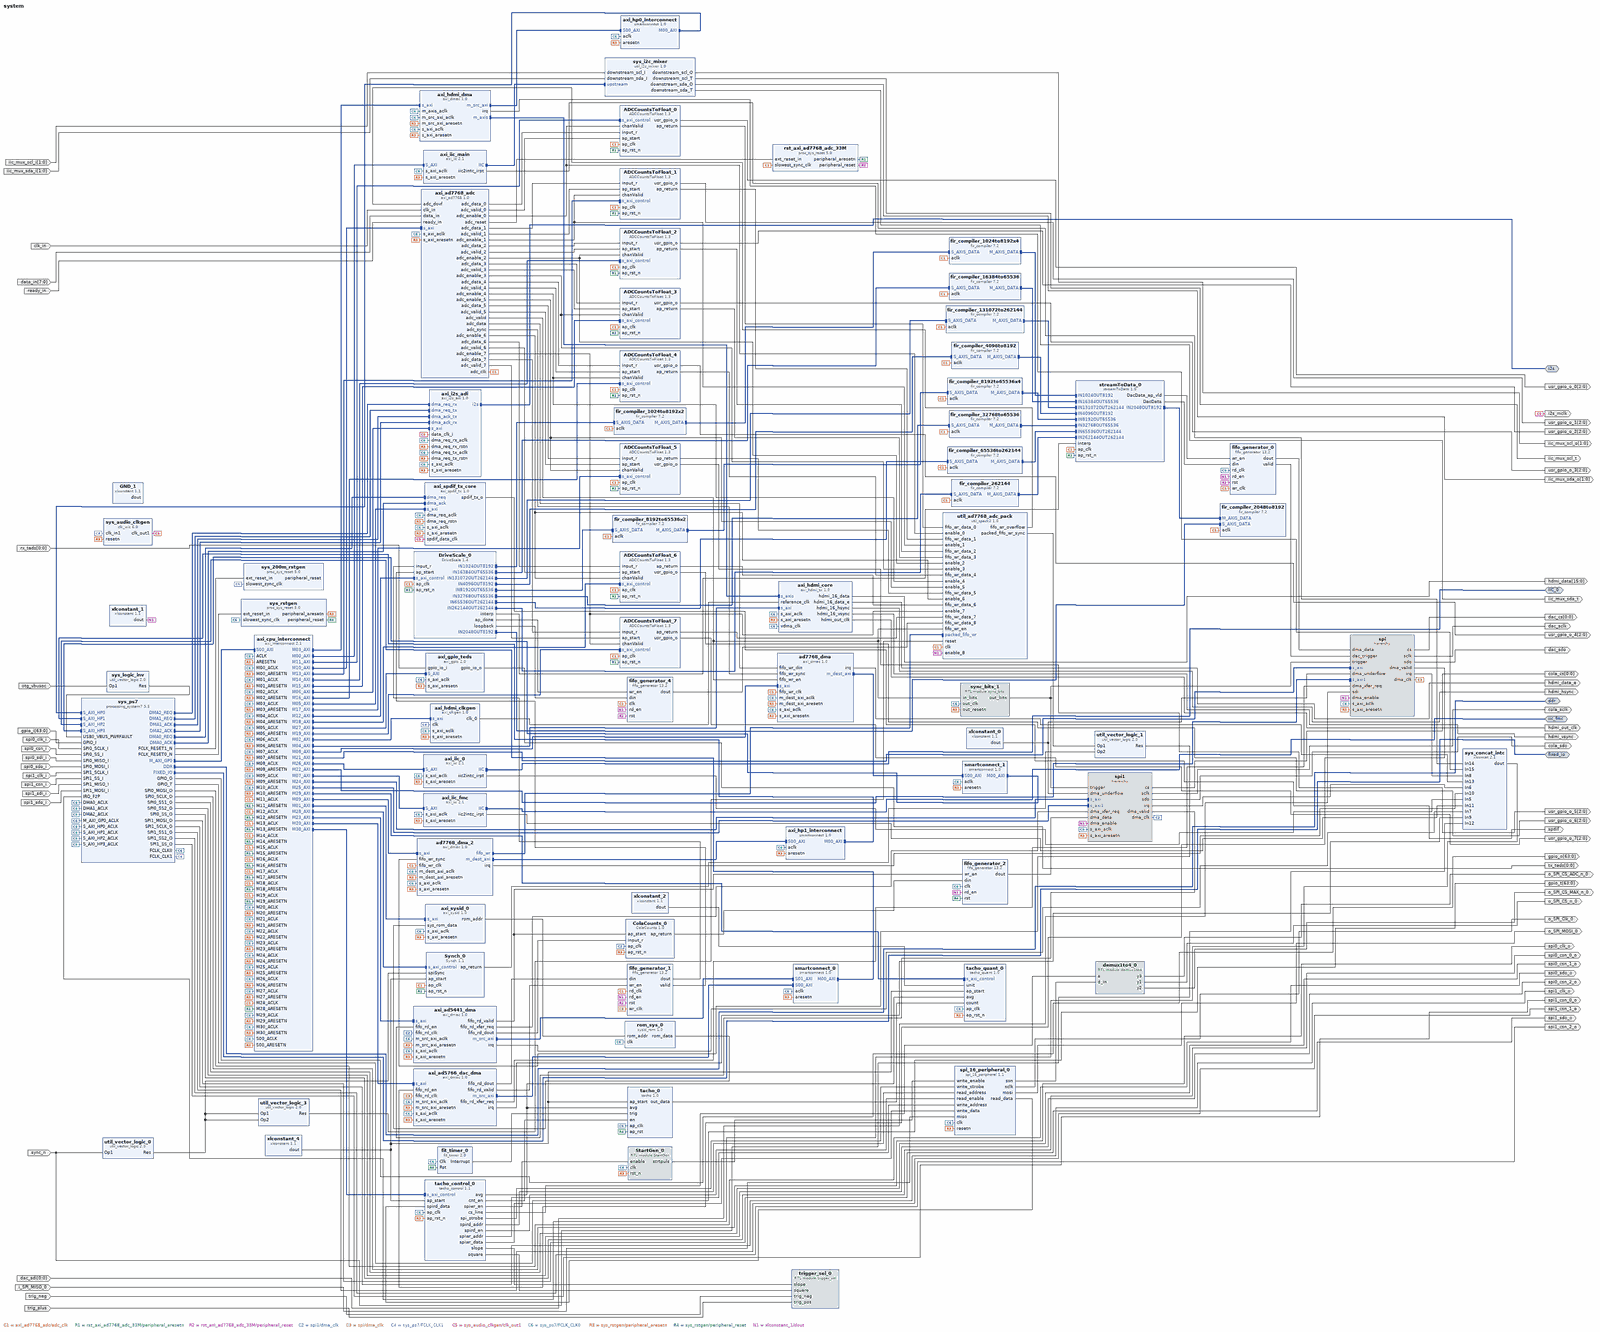
[diagram p0: block diagram of the top level, whole]
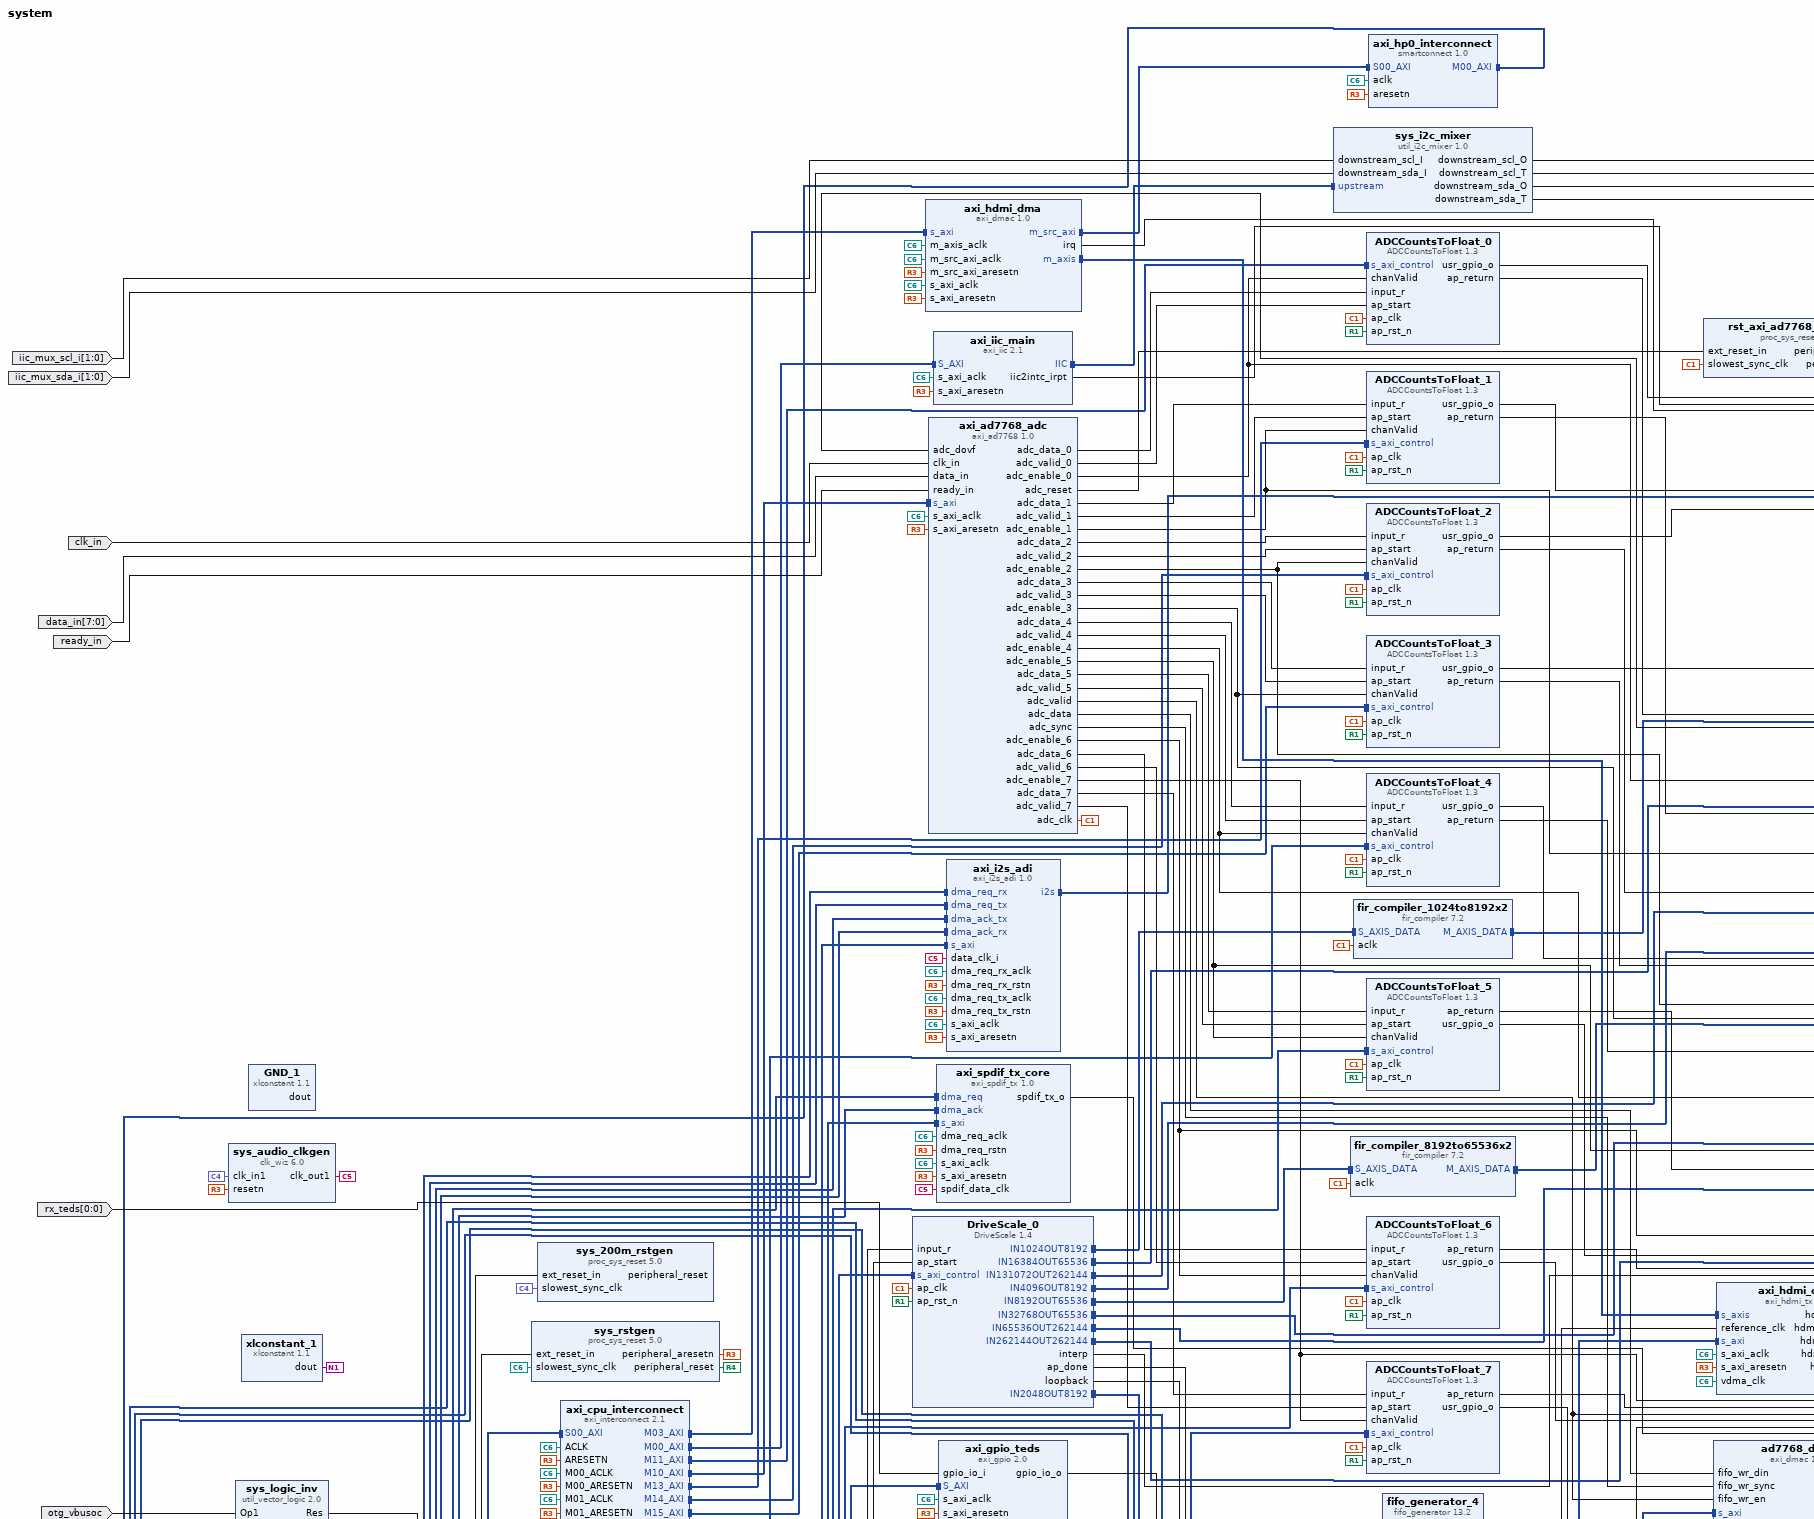
[diagram p1: block diagram of the top level, upper left part]
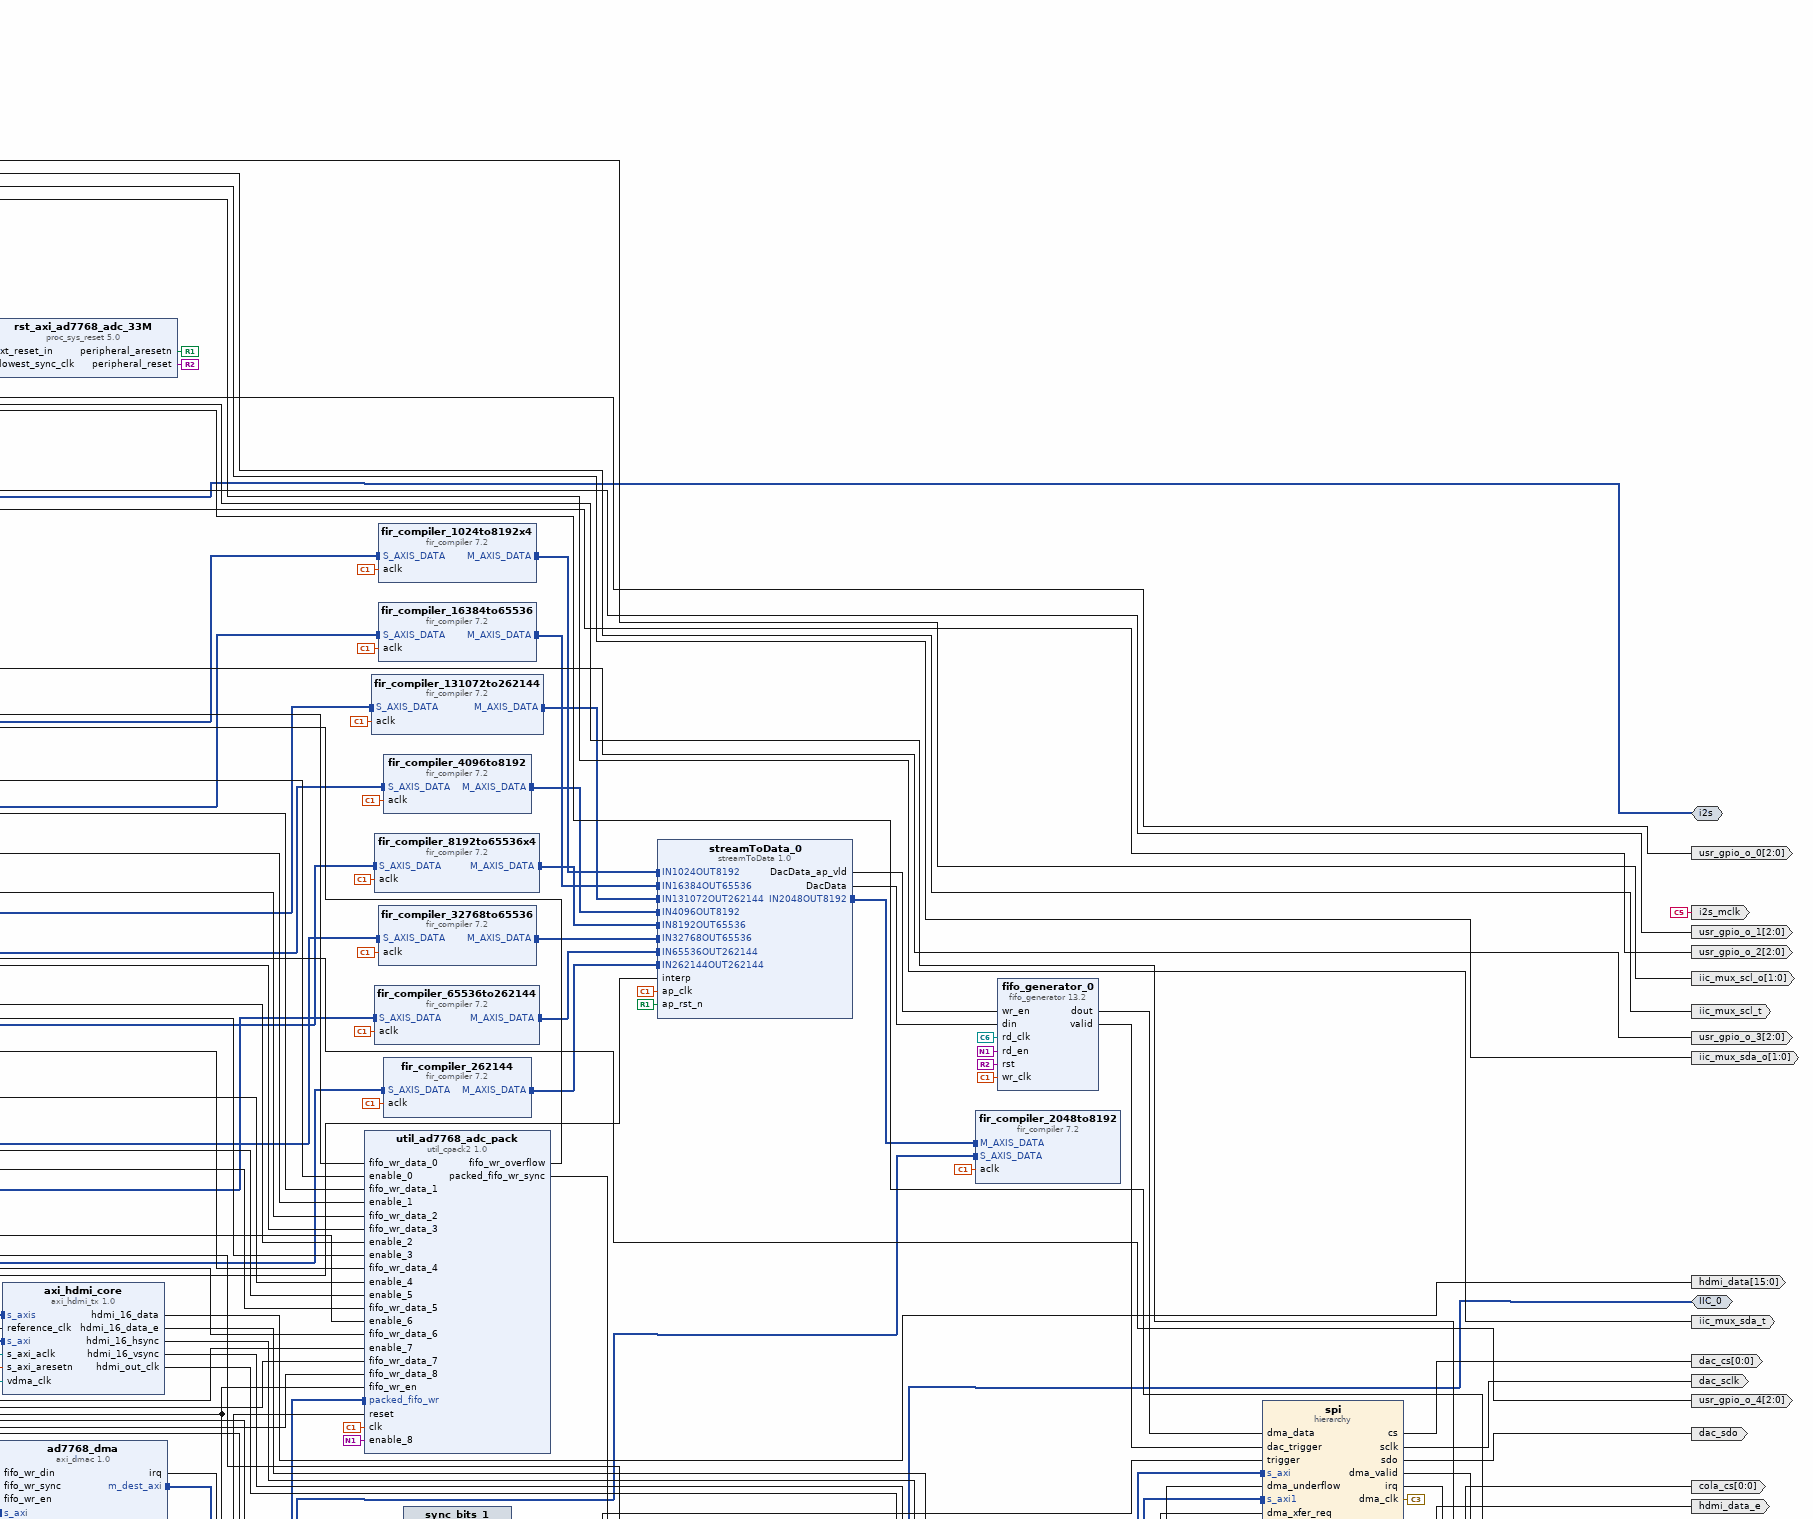
[diagram p2: block diagram of the top level, upper right part]
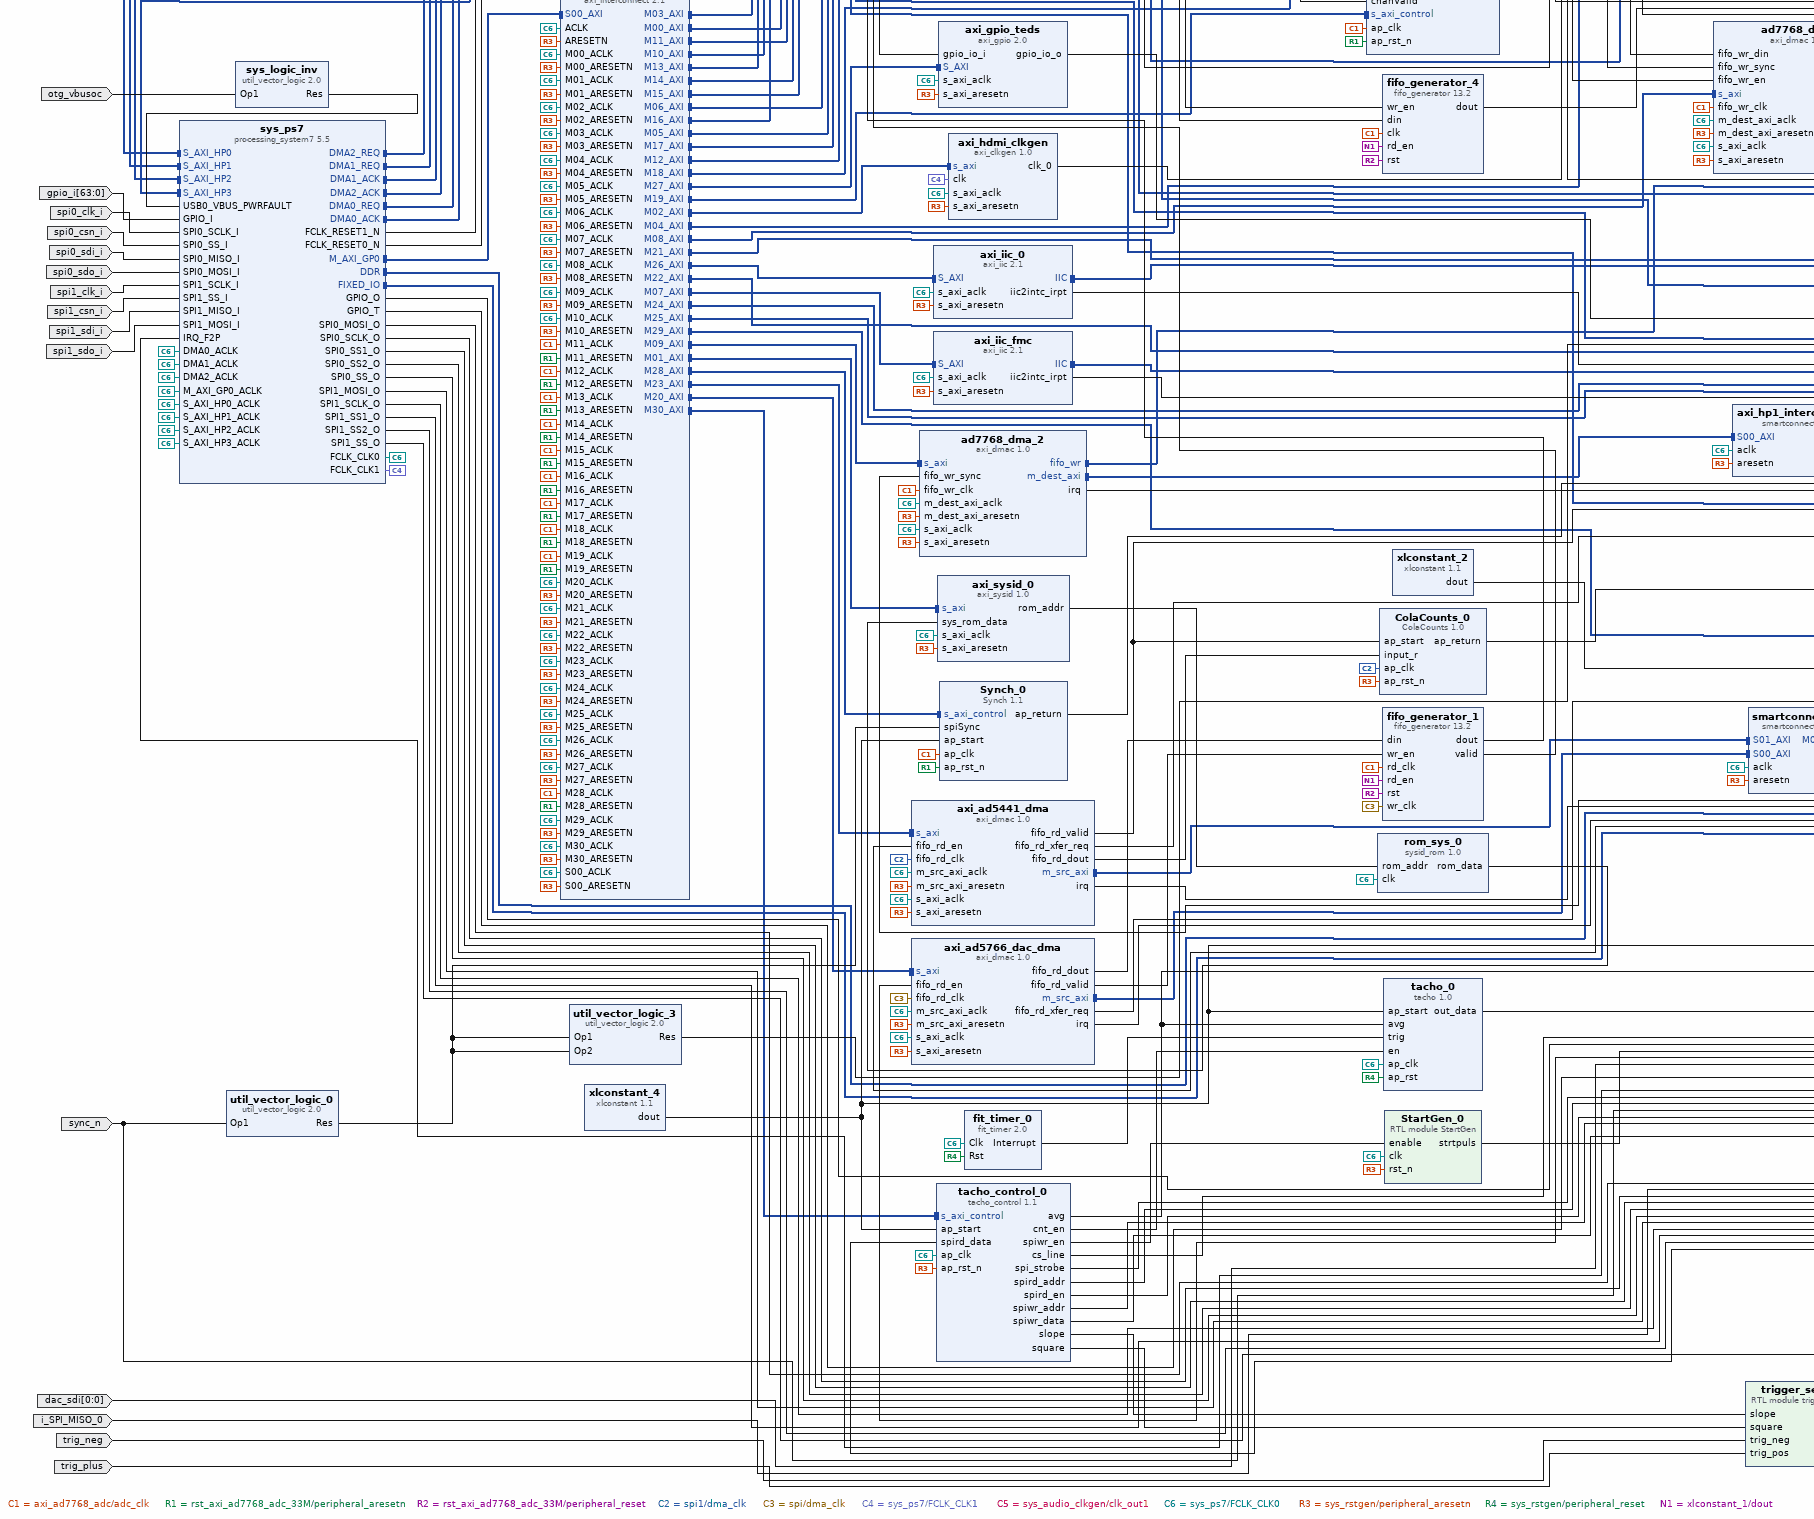
[diagram p3: block diagram of the top level, lower left part]
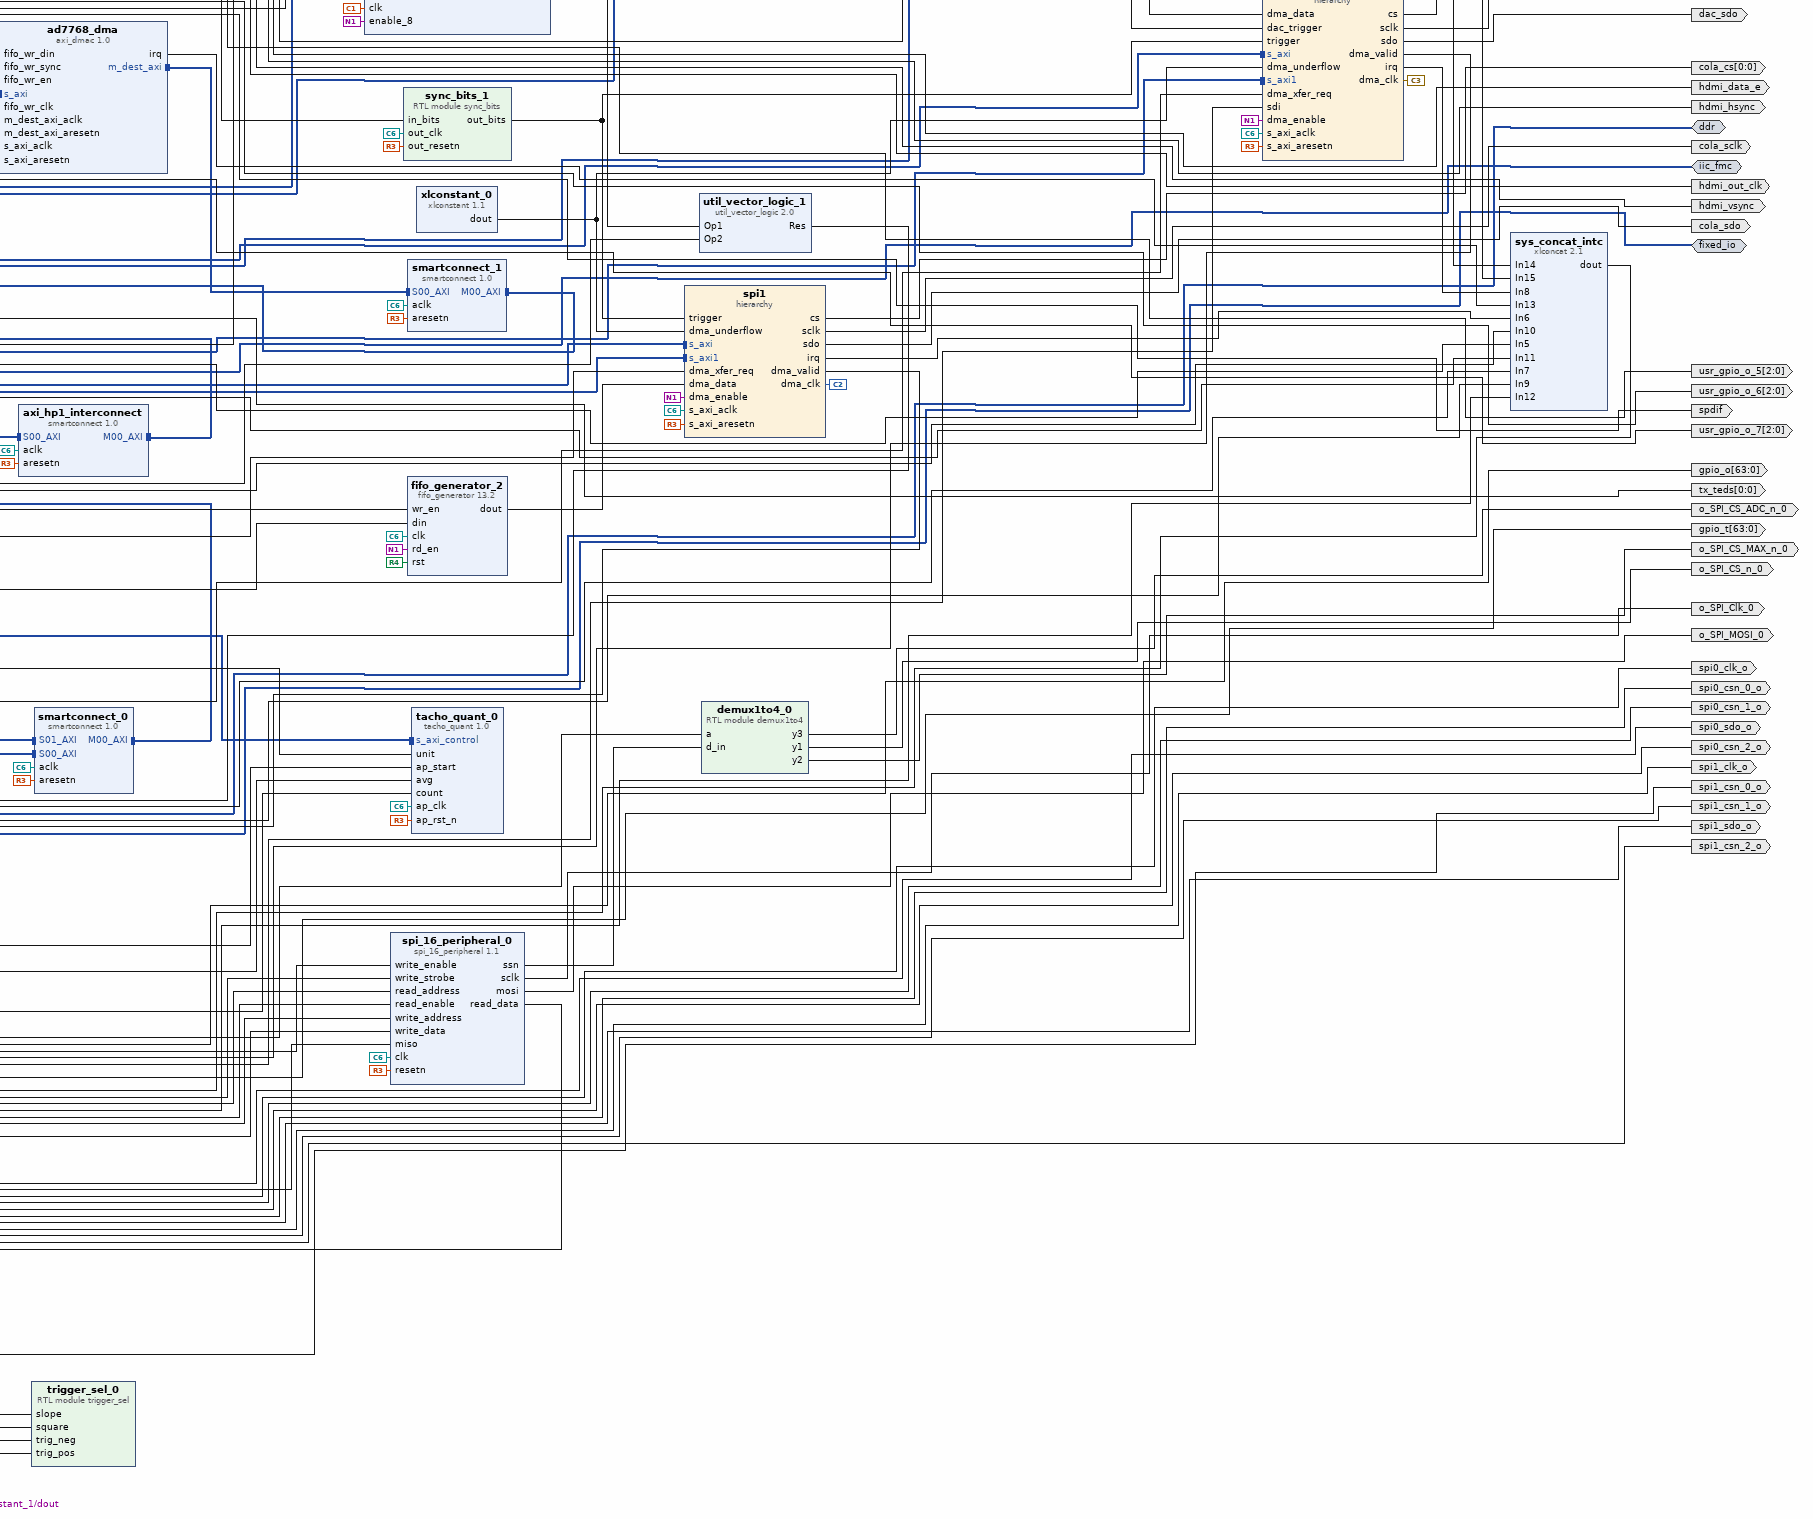
[diagram p4: block diagram of the top level, lower right part]
# Vivado block design system, xc7z020clg484-1, Vivado 2023.2
create_bd_design system

create_bd_intf_port -mode Master -vlnv xilinx.com:interface:ddrx_rtl:1.0 ddr
create_bd_intf_port -mode Master -vlnv xilinx.com:display_processing_system7:fixedio_rtl:1.0 fixed_io
create_bd_intf_port -mode Master -vlnv xilinx.com:interface:iic_rtl:1.0 iic_fmc
create_bd_intf_port -mode Master -vlnv analog.com:interface:i2s_rtl:1.0 i2s
create_bd_intf_port -mode Master -vlnv xilinx.com:interface:iic_rtl:1.0 IIC_0
create_bd_port -dir O spi0_csn_2_o
create_bd_port -dir O spi0_csn_1_o
create_bd_port -dir O spi0_csn_0_o
create_bd_port -dir I spi0_csn_i
create_bd_port -dir I spi0_clk_i
create_bd_port -dir O spi0_clk_o
create_bd_port -dir I spi0_sdo_i
create_bd_port -dir O spi0_sdo_o
create_bd_port -dir I spi0_sdi_i
create_bd_port -dir O spi1_csn_2_o
create_bd_port -dir O spi1_csn_1_o
create_bd_port -dir O spi1_csn_0_o
create_bd_port -dir I spi1_csn_i
create_bd_port -dir I spi1_clk_i
create_bd_port -dir O spi1_clk_o
create_bd_port -dir I spi1_sdo_i
create_bd_port -dir O spi1_sdo_o
create_bd_port -dir I spi1_sdi_i
create_bd_port -dir I -from 63 -to 0 gpio_i
create_bd_port -dir O -from 63 -to 0 gpio_o
create_bd_port -dir O -from 63 -to 0 gpio_t
create_bd_port -dir O hdmi_out_clk
create_bd_port -dir O hdmi_hsync
create_bd_port -dir O hdmi_vsync
create_bd_port -dir O hdmi_data_e
create_bd_port -dir O -from 15 -to 0 hdmi_data
create_bd_port -dir O -type clk i2s_mclk
create_bd_port -dir I -from 1 -to 0 iic_mux_scl_i
create_bd_port -dir O -from 1 -to 0 iic_mux_scl_o
create_bd_port -dir O iic_mux_scl_t
create_bd_port -dir I -from 1 -to 0 iic_mux_sda_i
create_bd_port -dir O -from 1 -to 0 iic_mux_sda_o
create_bd_port -dir O iic_mux_sda_t
create_bd_port -dir I otg_vbusoc
create_bd_port -dir O spdif
create_bd_port -dir I -from 7 -to 0 data_in
create_bd_port -dir O dac_sclk
create_bd_port -dir O -from 0 -to 0 dac_cs
create_bd_port -dir O dac_sdo
create_bd_port -dir I -from 0 -to 0 dac_sdi
create_bd_port -dir O cola_sclk
create_bd_port -dir O cola_sdo
create_bd_port -dir O -from 0 -to 0 cola_cs
create_bd_port -dir O -from 2 -to 0 -type data usr_gpio_o_0
create_bd_port -dir O -from 2 -to 0 -type data usr_gpio_o_1
create_bd_port -dir O -from 2 -to 0 -type data usr_gpio_o_2
create_bd_port -dir O -from 2 -to 0 -type data usr_gpio_o_3
create_bd_port -dir O -from 2 -to 0 -type data usr_gpio_o_4
create_bd_port -dir O -from 2 -to 0 -type data usr_gpio_o_5
create_bd_port -dir O -from 2 -to 0 -type data usr_gpio_o_6
create_bd_port -dir O -from 2 -to 0 -type data usr_gpio_o_7
create_bd_port -dir I -from 0 -to 0 rx_teds
create_bd_port -dir O -from 0 -to 0 tx_teds
create_bd_port -dir I -type intr sync_n
set_property -dict {CONFIG.SENSITIVITY EDGE_RISING} [get_bd_ports sync_n]
create_bd_port -dir I i_SPI_MISO_0
create_bd_port -dir O o_SPI_MOSI_0
create_bd_port -dir O o_SPI_Clk_0
create_bd_port -dir O o_SPI_CS_n_0
create_bd_port -dir O o_SPI_CS_MAX_n_0
create_bd_port -dir O o_SPI_CS_ADC_n_0
create_bd_port -dir I trig_neg
create_bd_port -dir I trig_plus
create_bd_port -dir I -type clk clk_in
set_property -dict {CONFIG.FREQ_HZ 33554432} [get_bd_ports clk_in]
create_bd_port -dir I ready_in

create_bd_cell -type ip -vlnv xilinx.com:ip:processing_system7:5.5 sys_ps7
set_property -dict [list \
  CONFIG.PCW_APU_PERIPHERAL_FREQMHZ 666.666667 \
  CONFIG.PCW_ENET0_ENET0_IO {MIO 16 .. 27} \
  CONFIG.PCW_ENET0_GRP_MDIO_ENABLE 1 \
  CONFIG.PCW_ENET0_GRP_MDIO_IO {MIO 52 .. 53} \
  CONFIG.PCW_ENET0_PERIPHERAL_ENABLE 1 \
  CONFIG.PCW_ENET0_RESET_ENABLE 0 \
  CONFIG.PCW_ENET_RESET_ENABLE 1 \
  CONFIG.PCW_ENET_RESET_SELECT {Share reset pin} \
  CONFIG.PCW_EN_CLK1_PORT 1 \
  CONFIG.PCW_EN_RST1_PORT 1 \
  CONFIG.PCW_FCLK_CLK1_BUF TRUE \
  CONFIG.PCW_FPGA0_PERIPHERAL_FREQMHZ 100 \
  CONFIG.PCW_FPGA1_PERIPHERAL_FREQMHZ 200.0 \
  CONFIG.PCW_FPGA2_PERIPHERAL_FREQMHZ 32.768 \
  CONFIG.PCW_FPGA_FCLK1_ENABLE 1 \
  CONFIG.PCW_GPIO_EMIO_GPIO_ENABLE 1 \
  CONFIG.PCW_GPIO_EMIO_GPIO_IO 64 \
  CONFIG.PCW_GPIO_MIO_GPIO_ENABLE 1 \
  CONFIG.PCW_GPIO_MIO_GPIO_IO MIO \
  CONFIG.PCW_I2C_RESET_ENABLE 1 \
  CONFIG.PCW_IMPORT_BOARD_PRESET ZedBoard \
  CONFIG.PCW_IRQ_F2P_INTR 1 \
  CONFIG.PCW_IRQ_F2P_MODE REVERSE \
  CONFIG.PCW_PRESET_BANK1_VOLTAGE {LVCMOS 1.8V} \
  CONFIG.PCW_QSPI_GRP_SINGLE_SS_ENABLE 1 \
  CONFIG.PCW_QSPI_GRP_SINGLE_SS_IO {MIO 1 .. 6} \
  CONFIG.PCW_QSPI_PERIPHERAL_ENABLE 1 \
  CONFIG.PCW_QSPI_QSPI_IO {MIO 1 .. 6} \
  CONFIG.PCW_SD0_GRP_CD_ENABLE 1 \
  CONFIG.PCW_SD0_GRP_CD_IO {MIO 47} \
  CONFIG.PCW_SD0_GRP_WP_ENABLE 1 \
  CONFIG.PCW_SD0_GRP_WP_IO {MIO 46} \
  CONFIG.PCW_SD0_PERIPHERAL_ENABLE 1 \
  CONFIG.PCW_SD0_SD0_IO {MIO 40 .. 45} \
  CONFIG.PCW_SDIO_PERIPHERAL_FREQMHZ 50 \
  CONFIG.PCW_SINGLE_QSPI_DATA_MODE x4 \
  CONFIG.PCW_SPI0_PERIPHERAL_ENABLE 1 \
  CONFIG.PCW_SPI0_SPI0_IO EMIO \
  CONFIG.PCW_SPI1_PERIPHERAL_ENABLE 1 \
  CONFIG.PCW_SPI1_SPI1_IO EMIO \
  CONFIG.PCW_UART1_PERIPHERAL_ENABLE 1 \
  CONFIG.PCW_UART1_UART1_IO {MIO 48 .. 49} \
  CONFIG.PCW_UART_PERIPHERAL_FREQMHZ 50 \
  CONFIG.PCW_UIPARAM_DDR_FREQ_MHZ 533.333313 \
  CONFIG.PCW_UIPARAM_DDR_PARTNO {MT41J128M16 HA-15E} \
  CONFIG.PCW_USB0_PERIPHERAL_ENABLE 1 \
  CONFIG.PCW_USB0_RESET_ENABLE 0 \
  CONFIG.PCW_USB0_USB0_IO {MIO 28 .. 39} \
  CONFIG.PCW_USB_RESET_ENABLE 1 \
  CONFIG.PCW_USB_RESET_SELECT {Share reset pin} \
  CONFIG.PCW_USE_DMA0 1 \
  CONFIG.PCW_USE_DMA1 1 \
  CONFIG.PCW_USE_DMA2 1 \
  CONFIG.PCW_USE_FABRIC_INTERRUPT 1 \
  CONFIG.PCW_USE_S_AXI_HP0 1 \
  CONFIG.PCW_USE_S_AXI_HP1 1 \
  CONFIG.PCW_USE_S_AXI_HP2 1 \
  CONFIG.PCW_USE_S_AXI_HP3 1 \
] [get_bd_cells sys_ps7]
# 426 more settings of sys_ps7 are not shown: defaults, MIO pin electricals, DDR timing, and values the tool derives
create_bd_cell -type ip -vlnv xilinx.com:ip:axi_iic:2.1 axi_iic_main
set_property -dict {CONFIG.IIC_BOARD_INTERFACE Custom CONFIG.USE_BOARD_FLOW true} [get_bd_cells axi_iic_main]
create_bd_cell -type ip -vlnv analog.com:user:util_i2c_mixer:1.0 sys_i2c_mixer
create_bd_cell -type ip -vlnv xilinx.com:ip:xlconcat:2.1 sys_concat_intc
set_property -dict {CONFIG.NUM_PORTS 16 CONFIG.dout_width 16} [get_bd_cells sys_concat_intc]
create_bd_cell -type ip -vlnv xilinx.com:ip:proc_sys_reset:5.0 sys_rstgen
set_property -dict {CONFIG.C_EXT_RST_WIDTH 1} [get_bd_cells sys_rstgen]
create_bd_cell -type ip -vlnv xilinx.com:ip:proc_sys_reset:5.0 sys_200m_rstgen
set_property -dict {CONFIG.C_EXT_RST_WIDTH 1} [get_bd_cells sys_200m_rstgen]
create_bd_cell -type ip -vlnv xilinx.com:ip:util_vector_logic:2.0 sys_logic_inv
set_property -dict {CONFIG.C_OPERATION not CONFIG.C_SIZE 1} [get_bd_cells sys_logic_inv]
create_bd_cell -type ip -vlnv analog.com:user:axi_clkgen:1.0 axi_hdmi_clkgen
create_bd_cell -type ip -vlnv analog.com:user:axi_hdmi_tx:1.0 axi_hdmi_core
set_property -dict {CONFIG.INTERFACE 16_BIT} [get_bd_cells axi_hdmi_core]
create_bd_cell -type ip -vlnv analog.com:user:axi_dmac:1.0 axi_hdmi_dma
set_property -dict [list \
  CONFIG.AXI_SLICE_DEST false \
  CONFIG.AXI_SLICE_SRC false \
  CONFIG.CYCLIC true \
  CONFIG.DMA_2D_TRANSFER true \
  CONFIG.DMA_DATA_WIDTH_SRC 64 \
  CONFIG.DMA_TYPE_DEST 1 \
  CONFIG.DMA_TYPE_SRC 0 \
] [get_bd_cells axi_hdmi_dma]
create_bd_cell -type ip -vlnv xilinx.com:ip:clk_wiz:6.0 sys_audio_clkgen
set_property -dict [list \
  CONFIG.CLKIN1_JITTER_PS 50.0 \
  CONFIG.CLKOUT1_JITTER 327.996 \
  CONFIG.CLKOUT1_PHASE_ERROR 264.435 \
  CONFIG.CLKOUT1_REQUESTED_OUT_FREQ 12.288 \
  CONFIG.MMCM_CLKFBOUT_MULT_F 44.375 \
  CONFIG.MMCM_CLKIN1_PERIOD 5.000 \
  CONFIG.MMCM_CLKIN2_PERIOD 10.0 \
  CONFIG.MMCM_CLKOUT0_DIVIDE_F 80.250 \
  CONFIG.MMCM_DIVCLK_DIVIDE 9 \
  CONFIG.PRIM_SOURCE No_buffer \
  CONFIG.RESET_PORT resetn \
  CONFIG.RESET_TYPE ACTIVE_LOW \
  CONFIG.USE_LOCKED false \
  CONFIG.USE_PHASE_ALIGNMENT false \
  CONFIG.USE_RESET true \
] [get_bd_cells sys_audio_clkgen]
create_bd_cell -type ip -vlnv analog.com:user:axi_spdif_tx:1.0 axi_spdif_tx_core
set_property -dict {CONFIG.DMA_TYPE 1 CONFIG.S_AXI_ADDRESS_WIDTH 16} [get_bd_cells axi_spdif_tx_core]
create_bd_cell -type ip -vlnv analog.com:user:axi_i2s_adi:1.0 axi_i2s_adi
set_property -dict {CONFIG.DMA_TYPE 1 CONFIG.S_AXI_ADDRESS_WIDTH 16} [get_bd_cells axi_i2s_adi]
create_bd_cell -type ip -vlnv xilinx.com:ip:axi_iic:2.1 axi_iic_fmc
create_bd_cell -type ip -vlnv analog.com:user:axi_sysid:1.0 axi_sysid_0
set_property -dict {CONFIG.ROM_ADDR_BITS 9} [get_bd_cells axi_sysid_0]
create_bd_cell -type ip -vlnv analog.com:user:sysid_rom:1.0 rom_sys_0
set_property -dict [list \
  CONFIG.PATH_TO_FILE C:/github/hdl-master/projects/ad7768evb/zed/mem_init_sys.txt \
  CONFIG.ROM_ADDR_BITS 9 \
] [get_bd_cells rom_sys_0]
create_bd_cell -type ip -vlnv xilinx.com:ip:xlconstant:1.1 GND_1
set_property -dict {CONFIG.CONST_VAL 0 CONFIG.CONST_WIDTH 1} [get_bd_cells GND_1]
create_bd_cell -type ip -vlnv xilinx.com:ip:axi_interconnect:2.1 axi_cpu_interconnect
set_property -dict {CONFIG.NUM_MI 31} [get_bd_cells axi_cpu_interconnect]
create_bd_cell -type ip -vlnv xilinx.com:ip:smartconnect:1.0 axi_hp0_interconnect
set_property -dict {CONFIG.NUM_MI 1 CONFIG.NUM_SI 1} [get_bd_cells axi_hp0_interconnect]
create_bd_cell -type ip -vlnv analog.com:user:axi_dmac:1.0 ad7768_dma
set_property -dict [list \
  CONFIG.AXI_SLICE_DEST true \
  CONFIG.AXI_SLICE_SRC false \
  CONFIG.CYCLIC false \
  CONFIG.DMA_2D_TRANSFER false \
  CONFIG.DMA_DATA_WIDTH_SRC 32 \
  CONFIG.DMA_TYPE_DEST 0 \
  CONFIG.DMA_TYPE_SRC 2 \
  CONFIG.SYNC_TRANSFER_START true \
] [get_bd_cells ad7768_dma]
create_bd_cell -type ip -vlnv analog.com:user:axi_dmac:1.0 ad7768_dma_2
set_property -dict [list \
  CONFIG.AXI_SLICE_DEST true \
  CONFIG.AXI_SLICE_SRC false \
  CONFIG.CYCLIC false \
  CONFIG.DMA_2D_TRANSFER false \
  CONFIG.DMA_DATA_WIDTH_SRC 512 \
  CONFIG.DMA_TYPE_DEST 0 \
  CONFIG.DMA_TYPE_SRC 2 \
  CONFIG.MAX_BYTES_PER_BURST 4096 \
  CONFIG.SYNC_TRANSFER_START true \
] [get_bd_cells ad7768_dma_2]
create_bd_cell -type ip -vlnv analog.com:user:util_cpack2:1.0 util_ad7768_adc_pack
set_property -dict {CONFIG.NUM_OF_CHANNELS 9 CONFIG.SAMPLE_DATA_WIDTH 32} [get_bd_cells util_ad7768_adc_pack]
create_bd_cell -type ip -vlnv analog.com:user:axi_ad7768:1.0 axi_ad7768_adc
set_property -dict {CONFIG.NUM_CHANNELS 8} [get_bd_cells axi_ad7768_adc]
create_bd_cell -type ip -vlnv xilinx.com:ip:smartconnect:1.0 axi_hp1_interconnect
set_property -dict {CONFIG.NUM_MI 1 CONFIG.NUM_SI 1} [get_bd_cells axi_hp1_interconnect]
create_bd_cell -type ip -vlnv xilinx.com:ip:proc_sys_reset:5.0 rst_axi_ad7768_adc_33M
create_bd_cell -type hier spi
create_bd_cell -type ip -vlnv analog.com:user:axi_dmac:1.0 axi_ad5766_dac_dma
set_property -dict [list \
  CONFIG.ASYNC_CLK_SRC_DEST false \
  CONFIG.AXI_SLICE_DEST true \
  CONFIG.AXI_SLICE_SRC true \
  CONFIG.CYCLIC false \
  CONFIG.DMA_DATA_WIDTH_DEST 32 \
  CONFIG.DMA_TYPE_DEST 2 \
  CONFIG.DMA_TYPE_SRC 0 \
] [get_bd_cells axi_ad5766_dac_dma]
create_bd_cell -type ip -vlnv xilinx.com:ip:smartconnect:1.0 smartconnect_0
set_property -dict {CONFIG.NUM_SI 2} [get_bd_cells smartconnect_0]
create_bd_cell -type ip -vlnv xilinx.com:ip:xlconstant:1.1 xlconstant_1
create_bd_cell -type hier spi1
create_bd_cell -type ip -vlnv analog.com:user:axi_dmac:1.0 axi_ad5441_dma
set_property -dict [list \
  CONFIG.AXI_SLICE_DEST true \
  CONFIG.AXI_SLICE_SRC true \
  CONFIG.CYCLIC false \
  CONFIG.DMA_DATA_WIDTH_DEST 32 \
  CONFIG.DMA_TYPE_DEST 2 \
  CONFIG.DMA_TYPE_SRC 0 \
  CONFIG.FIFO_SIZE 32 \
] [get_bd_cells axi_ad5441_dma]
create_bd_cell -type ip -vlnv SpectralDynamics:hls:ColaCounts:1.0 ColaCounts_0
create_bd_cell -type ip -vlnv xilinx.com:ip:smartconnect:1.0 smartconnect_1
set_property -dict {CONFIG.NUM_SI 1} [get_bd_cells smartconnect_1]
create_bd_cell -type ip -vlnv xilinx.com:ip:axi_iic:2.1 axi_iic_0
create_bd_cell -type ip -vlnv xilinx.com:ip:axi_gpio:2.0 axi_gpio_teds
set_property -dict {CONFIG.C_GPIO_WIDTH 1} [get_bd_cells axi_gpio_teds]
create_bd_cell -type ip -vlnv xilinx.com:ip:util_vector_logic:2.0 util_vector_logic_0
set_property -dict {CONFIG.C_OPERATION not CONFIG.C_SIZE 1} [get_bd_cells util_vector_logic_0]
create_bd_cell -type ip -vlnv xilinx.com:ip:util_vector_logic:2.0 util_vector_logic_1
set_property -dict {CONFIG.C_OPERATION and CONFIG.C_SIZE 1} [get_bd_cells util_vector_logic_1]
create_bd_cell -type ip -vlnv xilinx.com:ip:util_vector_logic:2.0 util_vector_logic_3
set_property -dict {CONFIG.C_OPERATION or CONFIG.C_SIZE 1} [get_bd_cells util_vector_logic_3]
create_bd_cell -type ip -vlnv xilinx.com:hls:ADCCountsToFloat:1.3 ADCCountsToFloat_0
create_bd_cell -type ip -vlnv xilinx.com:hls:ADCCountsToFloat:1.3 ADCCountsToFloat_1
create_bd_cell -type ip -vlnv xilinx.com:hls:ADCCountsToFloat:1.3 ADCCountsToFloat_2
create_bd_cell -type ip -vlnv xilinx.com:hls:ADCCountsToFloat:1.3 ADCCountsToFloat_3
create_bd_cell -type ip -vlnv xilinx.com:hls:ADCCountsToFloat:1.3 ADCCountsToFloat_4
create_bd_cell -type ip -vlnv xilinx.com:hls:ADCCountsToFloat:1.3 ADCCountsToFloat_5
create_bd_cell -type ip -vlnv xilinx.com:hls:ADCCountsToFloat:1.3 ADCCountsToFloat_6
create_bd_cell -type ip -vlnv xilinx.com:hls:ADCCountsToFloat:1.3 ADCCountsToFloat_7
create_bd_cell -type ip -vlnv xilinx.com:hls:Synch:1.1 Synch_0
create_bd_cell -type ip -vlnv xilinx.com:ip:fir_compiler:7.2 fir_compiler_1024to8192x2
set_property -dict [list \
  CONFIG.BestPrecision true \
  CONFIG.Clock_Frequency 33.554432 \
  CONFIG.CoefficientSource COE_File \
  CONFIG.Coefficient_Fanout false \
  CONFIG.Coefficient_File {../DAC FIR Filters/D256_S1_D2_1024.coe} \
  CONFIG.Coefficient_Fractional_Bits 49 \
  CONFIG.Coefficient_Sets 1 \
  CONFIG.Coefficient_Sign Signed \
  CONFIG.Coefficient_Structure Symmetric \
  CONFIG.Coefficient_Width 49 \
  CONFIG.Control_Broadcast_Fanout false \
  CONFIG.Control_Column_Fanout false \
  CONFIG.Control_LUT_Pipeline false \
  CONFIG.Control_Path_Fanout false \
  CONFIG.Data_Fractional_Bits 0 \
  CONFIG.Data_Path_Broadcast false \
  CONFIG.Data_Path_Fanout false \
  CONFIG.Data_Width 21 \
  CONFIG.Decimation_Rate 1 \
  CONFIG.Disable_Half_Band_Centre_Tap false \
  CONFIG.Filter_Architecture Systolic_Multiply_Accumulate \
  CONFIG.Filter_Type Interpolation \
  CONFIG.Interpolation_Rate 2 \
  CONFIG.No_BRAM_Read_First_Mode false \
  CONFIG.No_SRL_Attributes false \
  CONFIG.Number_Channels 1 \
  CONFIG.Optimal_Column_Lengths false \
  CONFIG.Optimization_Goal Area \
  CONFIG.Optimization_List None \
  CONFIG.Optimization_Selection None \
  CONFIG.Other false \
  CONFIG.Output_Rounding_Mode Truncate_LSBs \
  CONFIG.Output_Width 23 \
  CONFIG.Pre_Adder_Pipeline false \
  CONFIG.Quantization Quantize_Only \
  CONFIG.RateSpecification Frequency_Specification \
  CONFIG.Sample_Frequency 0.001024 \
  CONFIG.Zero_Pack_Factor 1 \
] [get_bd_cells fir_compiler_1024to8192x2]
create_bd_cell -type ip -vlnv xilinx.com:ip:fir_compiler:7.2 fir_compiler_1024to8192x4
set_property -dict [list \
  CONFIG.BestPrecision true \
  CONFIG.Clock_Frequency 33.554432 \
  CONFIG.CoefficientSource COE_File \
  CONFIG.Coefficient_Fanout false \
  CONFIG.Coefficient_File {../DAC FIR Filters/D256_S2_D4_8192.coe} \
  CONFIG.Coefficient_Fractional_Bits 48 \
  CONFIG.Coefficient_Sets 1 \
  CONFIG.Coefficient_Sign Signed \
  CONFIG.Coefficient_Structure Symmetric \
  CONFIG.Coefficient_Width 47 \
  CONFIG.Control_Broadcast_Fanout false \
  CONFIG.Control_Column_Fanout false \
  CONFIG.Control_LUT_Pipeline false \
  CONFIG.Control_Path_Fanout false \
  CONFIG.Data_Fractional_Bits 0 \
  CONFIG.Data_Path_Broadcast false \
  CONFIG.Data_Path_Fanout false \
  CONFIG.Data_Width 23 \
  CONFIG.Decimation_Rate 1 \
  CONFIG.Disable_Half_Band_Centre_Tap false \
  CONFIG.Filter_Architecture Systolic_Multiply_Accumulate \
  CONFIG.Filter_Type Interpolation \
  CONFIG.Interpolation_Rate 4 \
  CONFIG.No_BRAM_Read_First_Mode false \
  CONFIG.No_SRL_Attributes false \
  CONFIG.Number_Channels 1 \
  CONFIG.Optimal_Column_Lengths false \
  CONFIG.Optimization_Goal Area \
  CONFIG.Optimization_List None \
  CONFIG.Optimization_Selection None \
  CONFIG.Other false \
  CONFIG.Output_Rounding_Mode Truncate_LSBs \
  CONFIG.Output_Width 24 \
  CONFIG.Pre_Adder_Pipeline false \
  CONFIG.Quantization Quantize_Only \
  CONFIG.RateSpecification Frequency_Specification \
  CONFIG.Sample_Frequency 0.002048 \
  CONFIG.Zero_Pack_Factor 1 \
] [get_bd_cells fir_compiler_1024to8192x4]
create_bd_cell -type ip -vlnv xilinx.com:ip:fifo_generator:13.2 fifo_generator_0
set_property -dict [list \
  CONFIG.Fifo_Implementation Independent_Clocks_Builtin_FIFO \
  CONFIG.Input_Data_Width 24 \
  CONFIG.Input_Depth 512 \
  CONFIG.Performance_Options First_Word_Fall_Through \
  CONFIG.Read_Clock_Frequency 100 \
  CONFIG.Valid_Flag true \
  CONFIG.Write_Clock_Frequency 33 \
  CONFIG.synchronization_stages 3 \
] [get_bd_cells fifo_generator_0]
create_bd_cell -type ip -vlnv xilinx.com:ip:fifo_generator:13.2 fifo_generator_1
set_property -dict [list \
  CONFIG.Fifo_Implementation Independent_Clocks_Builtin_FIFO \
  CONFIG.INTERFACE_TYPE Native \
  CONFIG.Input_Data_Width 32 \
  CONFIG.Input_Depth 512 \
  CONFIG.Performance_Options Standard_FIFO \
  CONFIG.Read_Clock_Frequency 33 \
  CONFIG.Valid_Flag true \
  CONFIG.Write_Clock_Frequency 100 \
  CONFIG.synchronization_stages 3 \
] [get_bd_cells fifo_generator_1]
create_bd_cell -type ip -vlnv xilinx.com:ip:fir_compiler:7.2 fir_compiler_8192to65536x2
set_property -dict [list \
  CONFIG.BestPrecision true \
  CONFIG.Clock_Frequency 33.554432 \
  CONFIG.CoefficientSource COE_File \
  CONFIG.Coefficient_Fanout false \
  CONFIG.Coefficient_File {../DAC FIR Filters/D32_S1_INT2_8192.coe} \
  CONFIG.Coefficient_Fractional_Bits 49 \
  CONFIG.Coefficient_Sets 1 \
  CONFIG.Coefficient_Sign Signed \
  CONFIG.Coefficient_Structure Symmetric \
  CONFIG.Coefficient_Width 49 \
  CONFIG.Control_Broadcast_Fanout false \
  CONFIG.Control_Column_Fanout false \
  CONFIG.Control_LUT_Pipeline false \
  CONFIG.Control_Path_Fanout false \
  CONFIG.Data_Fractional_Bits 0 \
  CONFIG.Data_Path_Broadcast false \
  CONFIG.Data_Path_Fanout false \
  CONFIG.Data_Width 21 \
  CONFIG.Decimation_Rate 1 \
  CONFIG.Disable_Half_Band_Centre_Tap false \
  CONFIG.Filter_Architecture Systolic_Multiply_Accumulate \
  CONFIG.Filter_Type Interpolation \
  CONFIG.Interpolation_Rate 2 \
  CONFIG.No_BRAM_Read_First_Mode false \
  CONFIG.No_SRL_Attributes false \
  CONFIG.Number_Channels 1 \
  CONFIG.Optimal_Column_Lengths false \
  CONFIG.Optimization_Goal Area \
  CONFIG.Optimization_List None \
  CONFIG.Optimization_Selection None \
  CONFIG.Other false \
  CONFIG.Output_Rounding_Mode Truncate_LSBs \
  CONFIG.Output_Width 23 \
  CONFIG.Pre_Adder_Pipeline false \
  CONFIG.Quantization Quantize_Only \
  CONFIG.RateSpecification Frequency_Specification \
  CONFIG.Sample_Frequency 0.008192 \
  CONFIG.Zero_Pack_Factor 1 \
] [get_bd_cells fir_compiler_8192to65536x2]
create_bd_cell -type ip -vlnv xilinx.com:ip:fir_compiler:7.2 fir_compiler_8192to65536x4
set_property -dict [list \
  CONFIG.BestPrecision true \
  CONFIG.Clock_Frequency 33.554432 \
  CONFIG.CoefficientSource COE_File \
  CONFIG.Coefficient_Fanout false \
  CONFIG.Coefficient_File {../DAC FIR Filters/D32_S2_INT4_16384.coe} \
  CONFIG.Coefficient_Fractional_Bits 48 \
  CONFIG.Coefficient_Sets 1 \
  CONFIG.Coefficient_Sign Signed \
  CONFIG.Coefficient_Structure Symmetric \
  CONFIG.Coefficient_Width 47 \
  CONFIG.Control_Broadcast_Fanout false \
  CONFIG.Control_Column_Fanout false \
  CONFIG.Control_LUT_Pipeline false \
  CONFIG.Control_Path_Fanout false \
  CONFIG.Data_Fractional_Bits 0 \
  CONFIG.Data_Path_Broadcast false \
  CONFIG.Data_Path_Fanout false \
  CONFIG.Data_Width 23 \
  CONFIG.Decimation_Rate 1 \
  CONFIG.Disable_Half_Band_Centre_Tap false \
  CONFIG.Filter_Architecture Systolic_Multiply_Accumulate \
  CONFIG.Filter_Type Interpolation \
  CONFIG.Interpolation_Rate 4 \
  CONFIG.No_BRAM_Read_First_Mode false \
  CONFIG.No_SRL_Attributes false \
  CONFIG.Number_Channels 1 \
  CONFIG.Optimal_Column_Lengths false \
  CONFIG.Optimization_Goal Area \
  CONFIG.Optimization_List None \
  CONFIG.Optimization_Selection None \
  CONFIG.Other false \
  CONFIG.Output_Rounding_Mode Truncate_LSBs \
  CONFIG.Output_Width 24 \
  CONFIG.Pre_Adder_Pipeline false \
  CONFIG.Quantization Quantize_Only \
  CONFIG.RateSpecification Frequency_Specification \
  CONFIG.Sample_Frequency 0.016384 \
  CONFIG.Zero_Pack_Factor 1 \
] [get_bd_cells fir_compiler_8192to65536x4]
create_bd_cell -type ip -vlnv xilinx.com:ip:fir_compiler:7.2 fir_compiler_2048to8192
set_property -dict [list \
  CONFIG.BestPrecision true \
  CONFIG.Clock_Frequency 33.554432 \
  CONFIG.CoefficientSource COE_File \
  CONFIG.Coefficient_Fanout false \
  CONFIG.Coefficient_File {../DAC FIR Filters/D128_INT4.coe} \
  CONFIG.Coefficient_Fractional_Bits 48 \
  CONFIG.Coefficient_Sets 1 \
  CONFIG.Coefficient_Sign Signed \
  CONFIG.Coefficient_Structure Symmetric \
  CONFIG.Coefficient_Width 47 \
  CONFIG.Control_Broadcast_Fanout false \
  CONFIG.Control_Column_Fanout false \
  CONFIG.Control_LUT_Pipeline false \
  CONFIG.Control_Path_Fanout false \
  CONFIG.Data_Fractional_Bits 0 \
  CONFIG.Data_Path_Broadcast false \
  CONFIG.Data_Path_Fanout false \
  CONFIG.Data_Sign Signed \
  CONFIG.Data_Width 21 \
  CONFIG.Decimation_Rate 1 \
  CONFIG.Disable_Half_Band_Centre_Tap false \
  CONFIG.Filter_Architecture Systolic_Multiply_Accumulate \
  CONFIG.Filter_Type Interpolation \
  CONFIG.Interpolation_Rate 4 \
  CONFIG.No_BRAM_Read_First_Mode false \
  CONFIG.No_SRL_Attributes false \
  CONFIG.Number_Channels 1 \
  CONFIG.Optimal_Column_Lengths false \
  CONFIG.Optimization_Goal Area \
  CONFIG.Optimization_List None \
  CONFIG.Optimization_Selection None \
  CONFIG.Other false \
  CONFIG.Output_Rounding_Mode Truncate_LSBs \
  CONFIG.Output_Width 23 \
  CONFIG.Pre_Adder_Pipeline false \
  CONFIG.Quantization Quantize_Only \
  CONFIG.RateSpecification Frequency_Specification \
  CONFIG.Sample_Frequency 0.002048 \
  CONFIG.Zero_Pack_Factor 1 \
] [get_bd_cells fir_compiler_2048to8192]
create_bd_cell -type ip -vlnv xilinx.com:ip:fir_compiler:7.2 fir_compiler_4096to8192
set_property -dict [list \
  CONFIG.BestPrecision true \
  CONFIG.Clock_Frequency 33.554432 \
  CONFIG.CoefficientSource COE_File \
  CONFIG.Coefficient_Fanout true \
  CONFIG.Coefficient_File {../DAC FIR Filters/D64_INT2.coe} \
  CONFIG.Coefficient_Fractional_Bits 49 \
  CONFIG.Coefficient_Sets 1 \
  CONFIG.Coefficient_Sign Signed \
  CONFIG.Coefficient_Structure Symmetric \
  CONFIG.Coefficient_Width 49 \
  CONFIG.Control_Broadcast_Fanout true \
  CONFIG.Control_Column_Fanout true \
  CONFIG.Control_LUT_Pipeline true \
  CONFIG.Control_Path_Fanout true \
  CONFIG.Data_Fractional_Bits 0 \
  CONFIG.Data_Path_Broadcast false \
  CONFIG.Data_Path_Fanout true \
  CONFIG.Data_Width 21 \
  CONFIG.Decimation_Rate 1 \
  CONFIG.Disable_Half_Band_Centre_Tap false \
  CONFIG.Filter_Architecture Systolic_Multiply_Accumulate \
  CONFIG.Filter_Type Interpolation \
  CONFIG.Interpolation_Rate 2 \
  CONFIG.No_BRAM_Read_First_Mode true \
  CONFIG.No_SRL_Attributes false \
  CONFIG.Number_Channels 1 \
  CONFIG.Optimal_Column_Lengths true \
  CONFIG.Optimization_Goal Speed \
  CONFIG.Optimization_List Data_Path_Fanout,Pre-Adder_Pipeline,Coefficient_Fanout,Control_Path_Fanout,Control_Column_Fanout,Control_Broadcast_Fanout,Control_LUT_Pipeline,No_BRAM_Read_First_Mode,Optimal_Column_Lengths,Other \
  CONFIG.Optimization_Selection All \
  CONFIG.Other true \
  CONFIG.Output_Rounding_Mode Truncate_LSBs \
  CONFIG.Output_Width 23 \
  CONFIG.Pre_Adder_Pipeline true \
  CONFIG.Quantization Quantize_Only \
  CONFIG.RateSpecification Frequency_Specification \
  CONFIG.Sample_Frequency 0.004096 \
  CONFIG.Zero_Pack_Factor 1 \
] [get_bd_cells fir_compiler_4096to8192]
create_bd_cell -type ip -vlnv xilinx.com:ip:fir_compiler:7.2 fir_compiler_16384to65536
set_property -dict [list \
  CONFIG.BestPrecision true \
  CONFIG.Clock_Frequency 33.554432 \
  CONFIG.CoefficientSource COE_File \
  CONFIG.Coefficient_Fanout false \
  CONFIG.Coefficient_File {../DAC FIR Filters/D16_INT4.coe} \
  CONFIG.Coefficient_Fractional_Bits 48 \
  CONFIG.Coefficient_Sets 1 \
  CONFIG.Coefficient_Sign Signed \
  CONFIG.Coefficient_Structure Symmetric \
  CONFIG.Coefficient_Width 47 \
  CONFIG.Control_Broadcast_Fanout false \
  CONFIG.Control_Column_Fanout false \
  CONFIG.Control_LUT_Pipeline false \
  CONFIG.Control_Path_Fanout false \
  CONFIG.Data_Fractional_Bits 0 \
  CONFIG.Data_Path_Broadcast false \
  CONFIG.Data_Path_Fanout false \
  CONFIG.Data_Width 21 \
  CONFIG.Decimation_Rate 1 \
  CONFIG.Disable_Half_Band_Centre_Tap false \
  CONFIG.Filter_Architecture Systolic_Multiply_Accumulate \
  CONFIG.Filter_Type Interpolation \
  CONFIG.Interpolation_Rate 4 \
  CONFIG.No_BRAM_Read_First_Mode false \
  CONFIG.No_SRL_Attributes false \
  CONFIG.Number_Channels 1 \
  CONFIG.Optimal_Column_Lengths false \
  CONFIG.Optimization_Goal Area \
  CONFIG.Optimization_List None \
  CONFIG.Optimization_Selection None \
  CONFIG.Other false \
  CONFIG.Output_Rounding_Mode Truncate_LSBs \
  CONFIG.Output_Width 23 \
  CONFIG.Pre_Adder_Pipeline false \
  CONFIG.Quantization Quantize_Only \
  CONFIG.RateSpecification Frequency_Specification \
  CONFIG.Sample_Frequency 0.016384 \
  CONFIG.Zero_Pack_Factor 1 \
] [get_bd_cells fir_compiler_16384to65536]
create_bd_cell -type ip -vlnv xilinx.com:ip:fir_compiler:7.2 fir_compiler_32768to65536
set_property -dict [list \
  CONFIG.BestPrecision true \
  CONFIG.Clock_Frequency 33.554432 \
  CONFIG.CoefficientSource COE_File \
  CONFIG.Coefficient_Fanout false \
  CONFIG.Coefficient_File {../DAC FIR Filters/D8_INT2.coe} \
  CONFIG.Coefficient_Fractional_Bits 49 \
  CONFIG.Coefficient_Sets 1 \
  CONFIG.Coefficient_Sign Signed \
  CONFIG.Coefficient_Structure Symmetric \
  CONFIG.Coefficient_Width 49 \
  CONFIG.Control_Broadcast_Fanout false \
  CONFIG.Control_Column_Fanout false \
  CONFIG.Control_LUT_Pipeline false \
  CONFIG.Control_Path_Fanout false \
  CONFIG.Data_Fractional_Bits 0 \
  CONFIG.Data_Path_Broadcast false \
  CONFIG.Data_Path_Fanout false \
  CONFIG.Data_Width 21 \
  CONFIG.Decimation_Rate 1 \
  CONFIG.Disable_Half_Band_Centre_Tap false \
  CONFIG.Filter_Architecture Systolic_Multiply_Accumulate \
  CONFIG.Filter_Type Interpolation \
  CONFIG.Interpolation_Rate 2 \
  CONFIG.No_BRAM_Read_First_Mode false \
  CONFIG.No_SRL_Attributes false \
  CONFIG.Number_Channels 1 \
  CONFIG.Optimal_Column_Lengths false \
  CONFIG.Optimization_Goal Area \
  CONFIG.Optimization_List None \
  CONFIG.Optimization_Selection None \
  CONFIG.Other false \
  CONFIG.Output_Rounding_Mode Truncate_LSBs \
  CONFIG.Output_Width 23 \
  CONFIG.Pre_Adder_Pipeline false \
  CONFIG.Quantization Quantize_Only \
  CONFIG.RateSpecification Frequency_Specification \
  CONFIG.Sample_Frequency 0.032768 \
  CONFIG.Zero_Pack_Factor 1 \
] [get_bd_cells fir_compiler_32768to65536]
create_bd_cell -type ip -vlnv xilinx.com:ip:fir_compiler:7.2 fir_compiler_65536to262144
set_property -dict [list \
  CONFIG.BestPrecision true \
  CONFIG.Clock_Frequency 33.554432 \
  CONFIG.CoefficientSource COE_File \
  CONFIG.Coefficient_Fanout false \
  CONFIG.Coefficient_File {../DAC FIR Filters/D4_INT4.coe} \
  CONFIG.Coefficient_Fractional_Bits 48 \
  CONFIG.Coefficient_Sets 1 \
  CONFIG.Coefficient_Sign Signed \
  CONFIG.Coefficient_Structure Symmetric \
  CONFIG.Coefficient_Width 47 \
  CONFIG.Control_Broadcast_Fanout false \
  CONFIG.Control_Column_Fanout false \
  CONFIG.Control_LUT_Pipeline false \
  CONFIG.Control_Path_Fanout false \
  CONFIG.Data_Path_Broadcast false \
  CONFIG.Data_Path_Fanout false \
  CONFIG.Data_Width 21 \
  CONFIG.Decimation_Rate 1 \
  CONFIG.Disable_Half_Band_Centre_Tap false \
  CONFIG.Filter_Architecture Systolic_Multiply_Accumulate \
  CONFIG.Filter_Type Interpolation \
  CONFIG.Interpolation_Rate 4 \
  CONFIG.No_BRAM_Read_First_Mode false \
  CONFIG.No_SRL_Attributes false \
  CONFIG.Number_Channels 1 \
  CONFIG.Optimal_Column_Lengths false \
  CONFIG.Optimization_Goal Area \
  CONFIG.Optimization_List None \
  CONFIG.Optimization_Selection None \
  CONFIG.Other false \
  CONFIG.Output_Rounding_Mode Truncate_LSBs \
  CONFIG.Output_Width 23 \
  CONFIG.Pre_Adder_Pipeline false \
  CONFIG.Quantization Quantize_Only \
  CONFIG.RateSpecification Frequency_Specification \
  CONFIG.Sample_Frequency 0.065536 \
  CONFIG.Zero_Pack_Factor 1 \
] [get_bd_cells fir_compiler_65536to262144]
create_bd_cell -type ip -vlnv xilinx.com:ip:fir_compiler:7.2 fir_compiler_131072to262144
set_property -dict [list \
  CONFIG.BestPrecision true \
  CONFIG.Clock_Frequency 33.554432 \
  CONFIG.CoefficientSource COE_File \
  CONFIG.Coefficient_Fanout false \
  CONFIG.Coefficient_File {../DAC FIR Filters/D2_INT2.coe} \
  CONFIG.Coefficient_Fractional_Bits 49 \
  CONFIG.Coefficient_Sets 1 \
  CONFIG.Coefficient_Sign Signed \
  CONFIG.Coefficient_Structure Symmetric \
  CONFIG.Coefficient_Width 49 \
  CONFIG.Control_Broadcast_Fanout false \
  CONFIG.Control_Column_Fanout false \
  CONFIG.Control_LUT_Pipeline false \
  CONFIG.Control_Path_Fanout false \
  CONFIG.Data_Fractional_Bits 0 \
  CONFIG.Data_Path_Broadcast false \
  CONFIG.Data_Path_Fanout false \
  CONFIG.Data_Width 21 \
  CONFIG.Decimation_Rate 1 \
  CONFIG.Disable_Half_Band_Centre_Tap false \
  CONFIG.Filter_Architecture Systolic_Multiply_Accumulate \
  CONFIG.Filter_Type Interpolation \
  CONFIG.Interpolation_Rate 2 \
  CONFIG.No_BRAM_Read_First_Mode false \
  CONFIG.No_SRL_Attributes false \
  CONFIG.Number_Channels 1 \
  CONFIG.Optimal_Column_Lengths false \
  CONFIG.Optimization_Goal Area \
  CONFIG.Optimization_List None \
  CONFIG.Optimization_Selection None \
  CONFIG.Other false \
  CONFIG.Output_Rounding_Mode Truncate_LSBs \
  CONFIG.Output_Width 22 \
  CONFIG.Pre_Adder_Pipeline false \
  CONFIG.Quantization Quantize_Only \
  CONFIG.RateSpecification Frequency_Specification \
  CONFIG.Sample_Frequency 0.131072 \
  CONFIG.Zero_Pack_Factor 1 \
] [get_bd_cells fir_compiler_131072to262144]
create_bd_cell -type ip -vlnv xilinx.com:ip:fir_compiler:7.2 fir_compiler_262144
set_property -dict [list \
  CONFIG.BestPrecision true \
  CONFIG.Clock_Frequency 33.554432 \
  CONFIG.CoefficientSource COE_File \
  CONFIG.CoefficientVector 6,0,-4,-3,5,6,-6,-13,7,44,64,44,7,-13,-6,6,5,-3,-4,0,6 \
  CONFIG.Coefficient_Fanout false \
  CONFIG.Coefficient_File {../DAC FIR Filters/D1_FIR.coe} \
  CONFIG.Coefficient_Fractional_Bits 48 \
  CONFIG.Coefficient_Sets 1 \
  CONFIG.Coefficient_Sign Signed \
  CONFIG.Coefficient_Structure Symmetric \
  CONFIG.Coefficient_Width 49 \
  CONFIG.Control_Broadcast_Fanout false \
  CONFIG.Control_Column_Fanout false \
  CONFIG.Control_LUT_Pipeline false \
  CONFIG.Control_Path_Fanout false \
  CONFIG.Data_Fractional_Bits 0 \
  CONFIG.Data_Path_Broadcast false \
  CONFIG.Data_Path_Fanout false \
  CONFIG.Data_Width 21 \
  CONFIG.Disable_Half_Band_Centre_Tap false \
  CONFIG.Filter_Architecture Systolic_Multiply_Accumulate \
  CONFIG.No_BRAM_Read_First_Mode false \
  CONFIG.No_SRL_Attributes false \
  CONFIG.Optimal_Column_Lengths false \
  CONFIG.Optimization_Goal Area \
  CONFIG.Optimization_List None \
  CONFIG.Optimization_Selection None \
  CONFIG.Other false \
  CONFIG.Output_Rounding_Mode Truncate_LSBs \
  CONFIG.Output_Width 22 \
  CONFIG.Pre_Adder_Pipeline false \
  CONFIG.Quantization Quantize_Only \
  CONFIG.Sample_Frequency 0.262144 \
] [get_bd_cells fir_compiler_262144]
create_bd_cell -type ip -vlnv xilinx.com:hls:streamToData:1.0 streamToData_0
create_bd_cell -type ip -vlnv SpectralDynamics:hls:DriveScale:1.4 DriveScale_0
create_bd_cell -type module -reference StartGen StartGen_0
create_bd_cell -type module -reference demux1to4 demux1to4_0
create_bd_cell -type ip -vlnv xilinx.com:hls:tacho:1.0 tacho_0
create_bd_cell -type ip -vlnv xilinx.com:hls:tacho_control:1.1 tacho_control_0
create_bd_cell -type ip -vlnv xilinx.com:user:spi_16_peripheral:1.1 spi_16_peripheral_0
create_bd_cell -type ip -vlnv xilinx.com:ip:xlconstant:1.1 xlconstant_4
create_bd_cell -type ip -vlnv xilinx.com:ip:fifo_generator:13.2 fifo_generator_4
set_property -dict [list \
  CONFIG.Fifo_Implementation Common_Clock_Builtin_FIFO \
  CONFIG.Input_Data_Width 32 \
  CONFIG.Input_Depth 512 \
  CONFIG.Performance_Options First_Word_Fall_Through \
  CONFIG.Valid_Flag false \
] [get_bd_cells fifo_generator_4]
create_bd_cell -type module -reference trigger_sel trigger_sel_0
create_bd_cell -type ip -vlnv xilinx.com:hls:tacho_quant:1.0 tacho_quant_0
create_bd_cell -type ip -vlnv xilinx.com:ip:xlconstant:1.1 xlconstant_2
set_property -dict {CONFIG.CONST_VAL 0 CONFIG.CONST_WIDTH 4} [get_bd_cells xlconstant_2]
create_bd_cell -type ip -vlnv xilinx.com:ip:fit_timer:2.0 fit_timer_0
set_property -dict {CONFIG.C_NO_CLOCKS 1000000} [get_bd_cells fit_timer_0]
create_bd_cell -type module -reference sync_bits sync_bits_1
create_bd_cell -type ip -vlnv xilinx.com:ip:xlconstant:1.1 xlconstant_0
set_property -dict {CONFIG.CONST_VAL 0} [get_bd_cells xlconstant_0]
create_bd_cell -type ip -vlnv xilinx.com:ip:fifo_generator:13.2 fifo_generator_2
set_property -dict [list \
  CONFIG.Fifo_Implementation Common_Clock_Builtin_FIFO \
  CONFIG.Input_Data_Width 16 \
  CONFIG.Input_Depth 512 \
] [get_bd_cells fifo_generator_2]

# ---- hierarchy /spi ----
current_bd_instance /spi
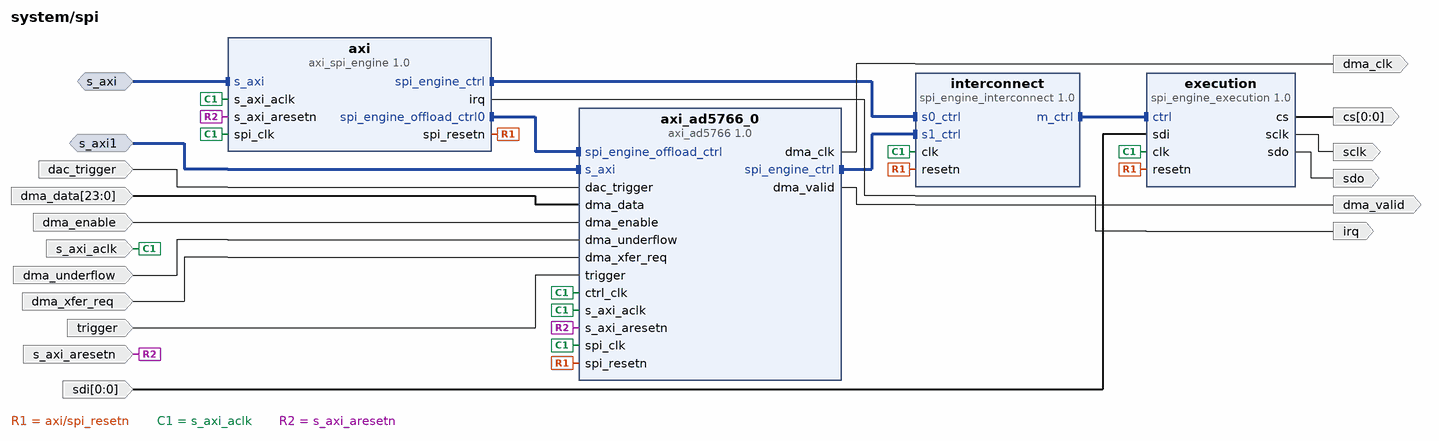
[diagram p5: block diagram inside /spi]
create_bd_intf_pin -mode Slave -vlnv xilinx.com:interface:aximm_rtl:1.0 s_axi
create_bd_intf_pin -mode Slave -vlnv xilinx.com:interface:aximm_rtl:1.0 s_axi1
create_bd_pin -dir I -type clk s_axi_aclk
create_bd_pin -dir I trigger
create_bd_pin -dir I dma_enable
create_bd_pin -dir O -type clk dma_clk
create_bd_pin -dir O dma_valid
create_bd_pin -dir O irq
create_bd_pin -dir I dma_xfer_req
create_bd_pin -dir I dma_underflow
create_bd_pin -dir I -type rst s_axi_aresetn
create_bd_pin -dir O sclk
create_bd_pin -dir O -from 0 -to 0 cs
create_bd_pin -dir O sdo
create_bd_pin -dir I -from 0 -to 0 sdi
create_bd_pin -dir I -from 23 -to 0 dma_data
create_bd_pin -dir I dac_trigger

create_bd_cell -type ip -vlnv analog.com:user:axi_spi_engine:1.0 axi
set_property -dict {CONFIG.ASYNC_SPI_CLK true CONFIG.DATA_WIDTH 24 CONFIG.NUM_OFFLOAD 1} [get_bd_cells axi]
create_bd_cell -type ip -vlnv analog.com:user:spi_engine_execution:1.0 execution
set_property -dict {CONFIG.DATA_WIDTH 24 CONFIG.DEFAULT_CLK_DIV 2 CONFIG.DEFAULT_SPI_CFG 3} [get_bd_cells execution]
create_bd_cell -type ip -vlnv analog.com:user:spi_engine_interconnect:1.0 interconnect
set_property -dict {CONFIG.DATA_WIDTH 24} [get_bd_cells interconnect]
create_bd_cell -type ip -vlnv analog.com:user:axi_ad5766:1.0 axi_ad5766_0
set_property -dict [list \
  CONFIG.DEV_PACKAGE false \
  CONFIG.FPGA_FAMILY false \
  CONFIG.FPGA_TECHNOLOGY true \
  CONFIG.SPEED_GRADE 10 \
] [get_bd_cells axi_ad5766_0]

# ---- hierarchy /spi1 ----
current_bd_instance /spi1
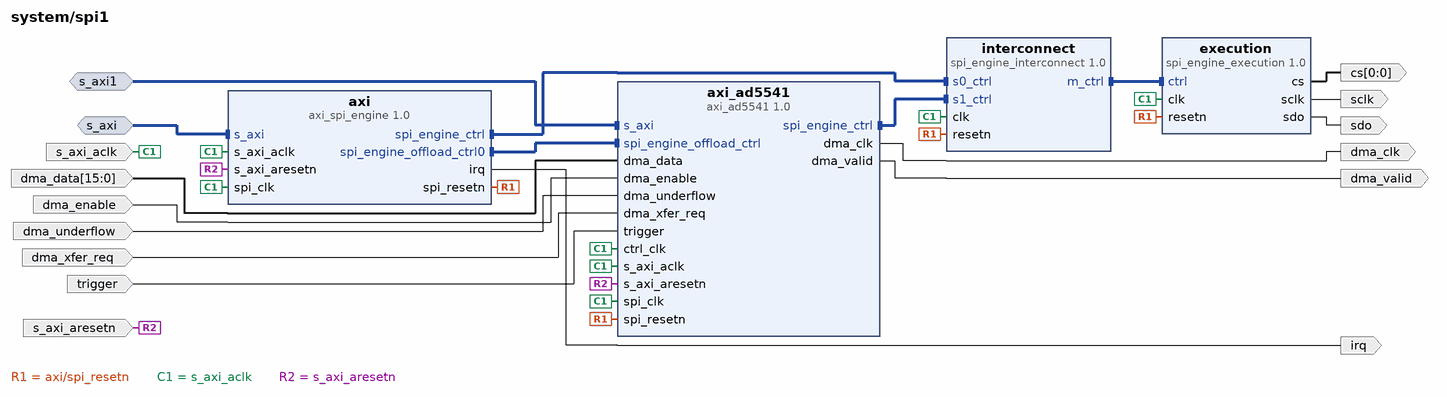
[diagram p6: block diagram inside /spi1]
create_bd_intf_pin -mode Slave -vlnv xilinx.com:interface:aximm_rtl:1.0 s_axi
create_bd_intf_pin -mode Slave -vlnv xilinx.com:interface:aximm_rtl:1.0 s_axi1
create_bd_pin -dir I -type clk s_axi_aclk
create_bd_pin -dir O sclk
create_bd_pin -dir O sdo
create_bd_pin -dir O -from 0 -to 0 cs
create_bd_pin -dir I -type rst s_axi_aresetn
create_bd_pin -dir I trigger
create_bd_pin -dir I dma_enable
create_bd_pin -dir I -from 15 -to 0 dma_data
create_bd_pin -dir O -type clk dma_clk
create_bd_pin -dir O dma_valid
create_bd_pin -dir I dma_xfer_req
create_bd_pin -dir I dma_underflow
create_bd_pin -dir O irq

create_bd_cell -type ip -vlnv analog.com:user:axi_spi_engine:1.0 axi
set_property -dict {CONFIG.ASYNC_SPI_CLK true CONFIG.DATA_WIDTH 16 CONFIG.NUM_OFFLOAD 1} [get_bd_cells axi]
create_bd_cell -type ip -vlnv analog.com:user:spi_engine_execution:1.0 execution
set_property -dict {CONFIG.DATA_WIDTH 16} [get_bd_cells execution]
create_bd_cell -type ip -vlnv analog.com:user:spi_engine_interconnect:1.0 interconnect
set_property -dict {CONFIG.DATA_WIDTH 16} [get_bd_cells interconnect]
create_bd_cell -type ip -vlnv analog.com:user:axi_ad5541:1.0 axi_ad5541
set_property -dict [list \
  CONFIG.DEV_PACKAGE false \
  CONFIG.FPGA_FAMILY false \
  CONFIG.FPGA_TECHNOLOGY false \
  CONFIG.SPEED_GRADE -1 \
] [get_bd_cells axi_ad5541]

# ---- connections ----

current_bd_instance /spi
connect_bd_intf_net [get_bd_intf_pins axi/s_axi] [get_bd_intf_pins s_axi]
connect_bd_intf_net [get_bd_intf_pins axi_ad5766_0/s_axi] [get_bd_intf_pins s_axi1]
connect_bd_intf_net [get_bd_intf_pins axi_ad5766_0/spi_engine_ctrl] [get_bd_intf_pins interconnect/s1_ctrl]
connect_bd_intf_net [get_bd_intf_pins axi/spi_engine_ctrl] [get_bd_intf_pins interconnect/s0_ctrl]
connect_bd_intf_net [get_bd_intf_pins axi/spi_engine_offload_ctrl0] [get_bd_intf_pins axi_ad5766_0/spi_engine_offload_ctrl]
connect_bd_intf_net [get_bd_intf_pins interconnect/m_ctrl] [get_bd_intf_pins execution/ctrl]
connect_bd_net [get_bd_pins axi_ad5766_0/dma_clk] [get_bd_pins dma_clk]
connect_bd_net [get_bd_pins axi_ad5766_0/dma_valid] [get_bd_pins dma_valid]
connect_bd_net [get_bd_pins axi/irq] [get_bd_pins irq]
connect_bd_net [get_bd_pins axi/spi_resetn] [get_bd_pins execution/resetn] [get_bd_pins interconnect/resetn] [get_bd_pins axi_ad5766_0/spi_resetn]
connect_bd_net [get_bd_pins dac_trigger] [get_bd_pins axi_ad5766_0/dac_trigger]
connect_bd_net [get_bd_pins dma_data] [get_bd_pins axi_ad5766_0/dma_data]
connect_bd_net [get_bd_pins dma_enable] [get_bd_pins axi_ad5766_0/dma_enable]
connect_bd_net [get_bd_pins dma_underflow] [get_bd_pins axi_ad5766_0/dma_underflow]
connect_bd_net [get_bd_pins dma_xfer_req] [get_bd_pins axi_ad5766_0/dma_xfer_req]
connect_bd_net [get_bd_pins execution/cs] [get_bd_pins cs]
connect_bd_net [get_bd_pins execution/sclk] [get_bd_pins sclk]
connect_bd_net [get_bd_pins execution/sdo] [get_bd_pins sdo]
connect_bd_net [get_bd_pins s_axi_aclk] \
  [get_bd_pins axi/s_axi_aclk] [get_bd_pins execution/clk] [get_bd_pins interconnect/clk] [get_bd_pins axi/spi_clk] \
  [get_bd_pins axi_ad5766_0/s_axi_aclk] [get_bd_pins axi_ad5766_0/spi_clk] [get_bd_pins axi_ad5766_0/ctrl_clk]
connect_bd_net [get_bd_pins s_axi_aresetn] [get_bd_pins axi/s_axi_aresetn] [get_bd_pins axi_ad5766_0/s_axi_aresetn]
connect_bd_net -net sdi_0_1 [get_bd_pins sdi] [get_bd_pins execution/sdi]
connect_bd_net [get_bd_pins trigger] [get_bd_pins axi_ad5766_0/trigger]

current_bd_instance /spi1
connect_bd_intf_net [get_bd_intf_pins axi/s_axi] [get_bd_intf_pins s_axi]
connect_bd_intf_net [get_bd_intf_pins axi_ad5541/s_axi] [get_bd_intf_pins s_axi1]
connect_bd_intf_net -intf_net axi_ad5541_0_spi_engine_ctrl [get_bd_intf_pins interconnect/s1_ctrl] [get_bd_intf_pins axi_ad5541/spi_engine_ctrl]
connect_bd_intf_net [get_bd_intf_pins axi/spi_engine_ctrl] [get_bd_intf_pins interconnect/s0_ctrl]
connect_bd_intf_net [get_bd_intf_pins axi/spi_engine_offload_ctrl0] [get_bd_intf_pins axi_ad5541/spi_engine_offload_ctrl]
connect_bd_intf_net [get_bd_intf_pins interconnect/m_ctrl] [get_bd_intf_pins execution/ctrl]
connect_bd_net [get_bd_pins axi/spi_resetn] [get_bd_pins interconnect/resetn] [get_bd_pins execution/resetn] [get_bd_pins axi_ad5541/spi_resetn]
connect_bd_net -net axi_ad5541_0_dma_clk [get_bd_pins axi_ad5541/dma_clk] [get_bd_pins dma_clk]
connect_bd_net -net axi_ad5541_0_dma_valid [get_bd_pins axi_ad5541/dma_valid] [get_bd_pins dma_valid]
connect_bd_net [get_bd_pins axi/irq] [get_bd_pins irq]
connect_bd_net [get_bd_pins dma_data] [get_bd_pins axi_ad5541/dma_data]
connect_bd_net [get_bd_pins dma_enable] [get_bd_pins axi_ad5541/dma_enable]
connect_bd_net [get_bd_pins dma_underflow] [get_bd_pins axi_ad5541/dma_underflow]
connect_bd_net [get_bd_pins dma_xfer_req] [get_bd_pins axi_ad5541/dma_xfer_req]
connect_bd_net [get_bd_pins s_axi_aclk] \
  [get_bd_pins axi/s_axi_aclk] [get_bd_pins axi/spi_clk] [get_bd_pins interconnect/clk] [get_bd_pins execution/clk] \
  [get_bd_pins axi_ad5541/s_axi_aclk] [get_bd_pins axi_ad5541/spi_clk] [get_bd_pins axi_ad5541/ctrl_clk]
connect_bd_net [get_bd_pins s_axi_aresetn] [get_bd_pins axi/s_axi_aresetn] [get_bd_pins axi_ad5541/s_axi_aresetn]
connect_bd_net -net spi_engine_execution_0_cs [get_bd_pins execution/cs] [get_bd_pins cs]
connect_bd_net -net spi_engine_execution_0_sclk [get_bd_pins execution/sclk] [get_bd_pins sclk]
connect_bd_net -net spi_engine_execution_0_sdo [get_bd_pins execution/sdo] [get_bd_pins sdo]
connect_bd_net [get_bd_pins trigger] [get_bd_pins axi_ad5541/trigger]

current_bd_instance /
connect_bd_intf_net [get_bd_intf_pins DriveScale_0/IN1024OUT8192] [get_bd_intf_pins fir_compiler_1024to8192x2/S_AXIS_DATA]
connect_bd_intf_net [get_bd_intf_pins fir_compiler_131072to262144/S_AXIS_DATA] [get_bd_intf_pins DriveScale_0/IN131072OUT262144]
connect_bd_intf_net [get_bd_intf_pins fir_compiler_16384to65536/S_AXIS_DATA] [get_bd_intf_pins DriveScale_0/IN16384OUT65536]
connect_bd_intf_net [get_bd_intf_pins fir_compiler_2048to8192/S_AXIS_DATA] [get_bd_intf_pins DriveScale_0/IN2048OUT8192]
connect_bd_intf_net [get_bd_intf_pins DriveScale_0/IN262144OUT262144] [get_bd_intf_pins fir_compiler_262144/S_AXIS_DATA]
connect_bd_intf_net [get_bd_intf_pins fir_compiler_32768to65536/S_AXIS_DATA] [get_bd_intf_pins DriveScale_0/IN32768OUT65536]
connect_bd_intf_net [get_bd_intf_pins DriveScale_0/IN4096OUT8192] [get_bd_intf_pins fir_compiler_4096to8192/S_AXIS_DATA]
connect_bd_intf_net [get_bd_intf_pins fir_compiler_65536to262144/S_AXIS_DATA] [get_bd_intf_pins DriveScale_0/IN65536OUT262144]
connect_bd_intf_net [get_bd_intf_pins DriveScale_0/IN8192OUT65536] [get_bd_intf_pins fir_compiler_8192to65536x2/S_AXIS_DATA]
connect_bd_intf_net [get_bd_intf_pins axi_cpu_interconnect/S00_AXI] [get_bd_intf_pins sys_ps7/M_AXI_GP0]
connect_bd_intf_net [get_bd_intf_pins ad7768_dma_2/m_dest_axi] [get_bd_intf_pins axi_hp1_interconnect/S00_AXI]
connect_bd_intf_net [get_bd_intf_pins ad7768_dma/m_dest_axi] [get_bd_intf_pins smartconnect_1/S00_AXI]
connect_bd_intf_net [get_bd_intf_pins axi_ad5441_dma/m_src_axi] [get_bd_intf_pins smartconnect_0/S01_AXI]
connect_bd_intf_net [get_bd_intf_pins axi_ad5766_dac_dma/m_src_axi] [get_bd_intf_pins smartconnect_0/S00_AXI]
connect_bd_intf_net [get_bd_intf_pins axi_cpu_interconnect/M00_AXI] [get_bd_intf_pins axi_iic_main/S_AXI]
connect_bd_intf_net [get_bd_intf_pins axi_cpu_interconnect/M01_AXI] [get_bd_intf_pins axi_sysid_0/s_axi]
connect_bd_intf_net [get_bd_intf_pins axi_cpu_interconnect/M02_AXI] [get_bd_intf_pins axi_hdmi_clkgen/s_axi]
connect_bd_intf_net [get_bd_intf_pins axi_cpu_interconnect/M03_AXI] [get_bd_intf_pins axi_hdmi_dma/s_axi]
connect_bd_intf_net [get_bd_intf_pins axi_cpu_interconnect/M04_AXI] [get_bd_intf_pins axi_hdmi_core/s_axi]
connect_bd_intf_net [get_bd_intf_pins axi_cpu_interconnect/M05_AXI] [get_bd_intf_pins axi_spdif_tx_core/s_axi]
connect_bd_intf_net [get_bd_intf_pins axi_cpu_interconnect/M06_AXI] [get_bd_intf_pins axi_i2s_adi/s_axi]
connect_bd_intf_net [get_bd_intf_pins axi_cpu_interconnect/M07_AXI] [get_bd_intf_pins axi_iic_fmc/S_AXI]
connect_bd_intf_net [get_bd_intf_pins axi_cpu_interconnect/M08_AXI] [get_bd_intf_pins ad7768_dma/s_axi]
connect_bd_intf_net [get_bd_intf_pins axi_cpu_interconnect/M09_AXI] [get_bd_intf_pins ad7768_dma_2/s_axi]
connect_bd_intf_net [get_bd_intf_pins axi_cpu_interconnect/M10_AXI] [get_bd_intf_pins axi_ad7768_adc/s_axi]
connect_bd_intf_net [get_bd_intf_pins axi_cpu_interconnect/M11_AXI] [get_bd_intf_pins ADCCountsToFloat_0/s_axi_control]
connect_bd_intf_net [get_bd_intf_pins axi_cpu_interconnect/M12_AXI] [get_bd_intf_pins DriveScale_0/s_axi_control]
connect_bd_intf_net [get_bd_intf_pins axi_cpu_interconnect/M13_AXI] [get_bd_intf_pins ADCCountsToFloat_1/s_axi_control]
connect_bd_intf_net [get_bd_intf_pins axi_cpu_interconnect/M14_AXI] [get_bd_intf_pins ADCCountsToFloat_2/s_axi_control]
connect_bd_intf_net [get_bd_intf_pins axi_cpu_interconnect/M15_AXI] [get_bd_intf_pins ADCCountsToFloat_3/s_axi_control]
connect_bd_intf_net [get_bd_intf_pins axi_cpu_interconnect/M16_AXI] [get_bd_intf_pins ADCCountsToFloat_4/s_axi_control]
connect_bd_intf_net [get_bd_intf_pins axi_cpu_interconnect/M17_AXI] [get_bd_intf_pins ADCCountsToFloat_5/s_axi_control]
connect_bd_intf_net [get_bd_intf_pins axi_cpu_interconnect/M18_AXI] [get_bd_intf_pins ADCCountsToFloat_6/s_axi_control]
connect_bd_intf_net [get_bd_intf_pins axi_cpu_interconnect/M19_AXI] [get_bd_intf_pins ADCCountsToFloat_7/s_axi_control]
connect_bd_intf_net [get_bd_intf_pins axi_cpu_interconnect/M20_AXI] [get_bd_intf_pins axi_ad5766_dac_dma/s_axi]
connect_bd_intf_net [get_bd_intf_pins axi_cpu_interconnect/M21_AXI] [get_bd_intf_pins spi/s_axi]
connect_bd_intf_net [get_bd_intf_pins axi_cpu_interconnect/M22_AXI] [get_bd_intf_pins spi/s_axi1]
connect_bd_intf_net [get_bd_intf_pins axi_cpu_interconnect/M23_AXI] [get_bd_intf_pins axi_ad5441_dma/s_axi]
connect_bd_intf_net [get_bd_intf_pins axi_cpu_interconnect/M24_AXI] [get_bd_intf_pins spi1/s_axi]
connect_bd_intf_net [get_bd_intf_pins axi_cpu_interconnect/M25_AXI] [get_bd_intf_pins spi1/s_axi1]
connect_bd_intf_net [get_bd_intf_pins axi_cpu_interconnect/M26_AXI] [get_bd_intf_pins axi_iic_0/S_AXI]
connect_bd_intf_net [get_bd_intf_pins axi_cpu_interconnect/M27_AXI] [get_bd_intf_pins axi_gpio_teds/S_AXI]
connect_bd_intf_net [get_bd_intf_pins axi_cpu_interconnect/M28_AXI] [get_bd_intf_pins Synch_0/s_axi_control]
connect_bd_intf_net [get_bd_intf_pins axi_cpu_interconnect/M29_AXI] [get_bd_intf_pins tacho_quant_0/s_axi_control]
connect_bd_intf_net [get_bd_intf_pins axi_cpu_interconnect/M30_AXI] [get_bd_intf_pins tacho_control_0/s_axi_control]
connect_bd_intf_net [get_bd_intf_pins axi_hdmi_dma/m_axis] [get_bd_intf_pins axi_hdmi_core/s_axis]
connect_bd_intf_net [get_bd_intf_pins axi_hp0_interconnect/S00_AXI] [get_bd_intf_pins axi_hdmi_dma/m_src_axi]
connect_bd_intf_net [get_bd_intf_pins axi_hp0_interconnect/M00_AXI] [get_bd_intf_pins sys_ps7/S_AXI_HP0]
connect_bd_intf_net [get_bd_intf_pins axi_hp1_interconnect/M00_AXI] [get_bd_intf_pins sys_ps7/S_AXI_HP1]
connect_bd_intf_net [get_bd_intf_pins sys_ps7/DMA2_REQ] [get_bd_intf_pins axi_i2s_adi/dma_req_rx]
connect_bd_intf_net [get_bd_intf_pins sys_ps7/DMA1_REQ] [get_bd_intf_pins axi_i2s_adi/dma_req_tx]
connect_bd_intf_net [get_bd_intf_ports i2s] [get_bd_intf_pins axi_i2s_adi/i2s]
connect_bd_intf_net [get_bd_intf_ports IIC_0] [get_bd_intf_pins axi_iic_0/IIC]
connect_bd_intf_net [get_bd_intf_ports iic_fmc] [get_bd_intf_pins axi_iic_fmc/IIC]
connect_bd_intf_net [get_bd_intf_pins axi_iic_main/IIC] [get_bd_intf_pins sys_i2c_mixer/upstream]
connect_bd_intf_net [get_bd_intf_pins sys_ps7/DMA0_REQ] [get_bd_intf_pins axi_spdif_tx_core/dma_req]
connect_bd_intf_net -intf_net fir_compiler_0_M_AXIS_DATA [get_bd_intf_pins fir_compiler_1024to8192x4/M_AXIS_DATA] [get_bd_intf_pins streamToData_0/IN1024OUT8192]
connect_bd_intf_net -intf_net fir_compiler_0_M_AXIS_DATA1 [get_bd_intf_pins fir_compiler_65536to262144/M_AXIS_DATA] [get_bd_intf_pins streamToData_0/IN65536OUT262144]
connect_bd_intf_net -intf_net fir_compiler_0_M_AXIS_DATA2 [get_bd_intf_pins fir_compiler_131072to262144/M_AXIS_DATA] [get_bd_intf_pins streamToData_0/IN131072OUT262144]
connect_bd_intf_net [get_bd_intf_pins fir_compiler_1024to8192x2/M_AXIS_DATA] [get_bd_intf_pins fir_compiler_1024to8192x4/S_AXIS_DATA]
connect_bd_intf_net [get_bd_intf_pins fir_compiler_16384to65536/M_AXIS_DATA] [get_bd_intf_pins streamToData_0/IN16384OUT65536]
connect_bd_intf_net [get_bd_intf_pins streamToData_0/IN2048OUT8192] [get_bd_intf_pins fir_compiler_2048to8192/M_AXIS_DATA]
connect_bd_intf_net [get_bd_intf_pins fir_compiler_262144/M_AXIS_DATA] [get_bd_intf_pins streamToData_0/IN262144OUT262144]
connect_bd_intf_net [get_bd_intf_pins fir_compiler_32768to65536/M_AXIS_DATA] [get_bd_intf_pins streamToData_0/IN32768OUT65536]
connect_bd_intf_net -intf_net fir_compiler_3_M_AXIS_DATA [get_bd_intf_pins fir_compiler_8192to65536x4/M_AXIS_DATA] [get_bd_intf_pins streamToData_0/IN8192OUT65536]
connect_bd_intf_net [get_bd_intf_pins fir_compiler_4096to8192/M_AXIS_DATA] [get_bd_intf_pins streamToData_0/IN4096OUT8192]
connect_bd_intf_net [get_bd_intf_pins fir_compiler_8192to65536x2/M_AXIS_DATA] [get_bd_intf_pins fir_compiler_8192to65536x4/S_AXIS_DATA]
connect_bd_intf_net [get_bd_intf_pins smartconnect_0/M00_AXI] [get_bd_intf_pins sys_ps7/S_AXI_HP2]
connect_bd_intf_net [get_bd_intf_pins smartconnect_1/M00_AXI] [get_bd_intf_pins sys_ps7/S_AXI_HP3]
connect_bd_intf_net [get_bd_intf_ports ddr] [get_bd_intf_pins sys_ps7/DDR]
connect_bd_intf_net [get_bd_intf_pins sys_ps7/DMA0_ACK] [get_bd_intf_pins axi_spdif_tx_core/dma_ack]
connect_bd_intf_net [get_bd_intf_pins sys_ps7/DMA1_ACK] [get_bd_intf_pins axi_i2s_adi/dma_ack_tx]
connect_bd_intf_net [get_bd_intf_pins sys_ps7/DMA2_ACK] [get_bd_intf_pins axi_i2s_adi/dma_ack_rx]
connect_bd_intf_net [get_bd_intf_ports fixed_io] [get_bd_intf_pins sys_ps7/FIXED_IO]
connect_bd_intf_net [get_bd_intf_pins ad7768_dma_2/fifo_wr] [get_bd_intf_pins util_ad7768_adc_pack/packed_fifo_wr]
connect_bd_net [get_bd_pins ADCCountsToFloat_0/ap_return] [get_bd_pins util_ad7768_adc_pack/fifo_wr_data_0]
connect_bd_net [get_bd_pins ADCCountsToFloat_0/usr_gpio_o] [get_bd_ports usr_gpio_o_0]
connect_bd_net [get_bd_pins ADCCountsToFloat_1/ap_return] [get_bd_pins util_ad7768_adc_pack/fifo_wr_data_1]
connect_bd_net [get_bd_pins ADCCountsToFloat_1/usr_gpio_o] [get_bd_ports usr_gpio_o_1]
connect_bd_net [get_bd_pins ADCCountsToFloat_2/ap_return] [get_bd_pins util_ad7768_adc_pack/fifo_wr_data_2]
connect_bd_net [get_bd_pins ADCCountsToFloat_2/usr_gpio_o] [get_bd_ports usr_gpio_o_2]
connect_bd_net [get_bd_pins ADCCountsToFloat_3/ap_return] [get_bd_pins util_ad7768_adc_pack/fifo_wr_data_3]
